# EAGLE board SP-PC-2 (EAGLE 7.6.0), part 1 of 2
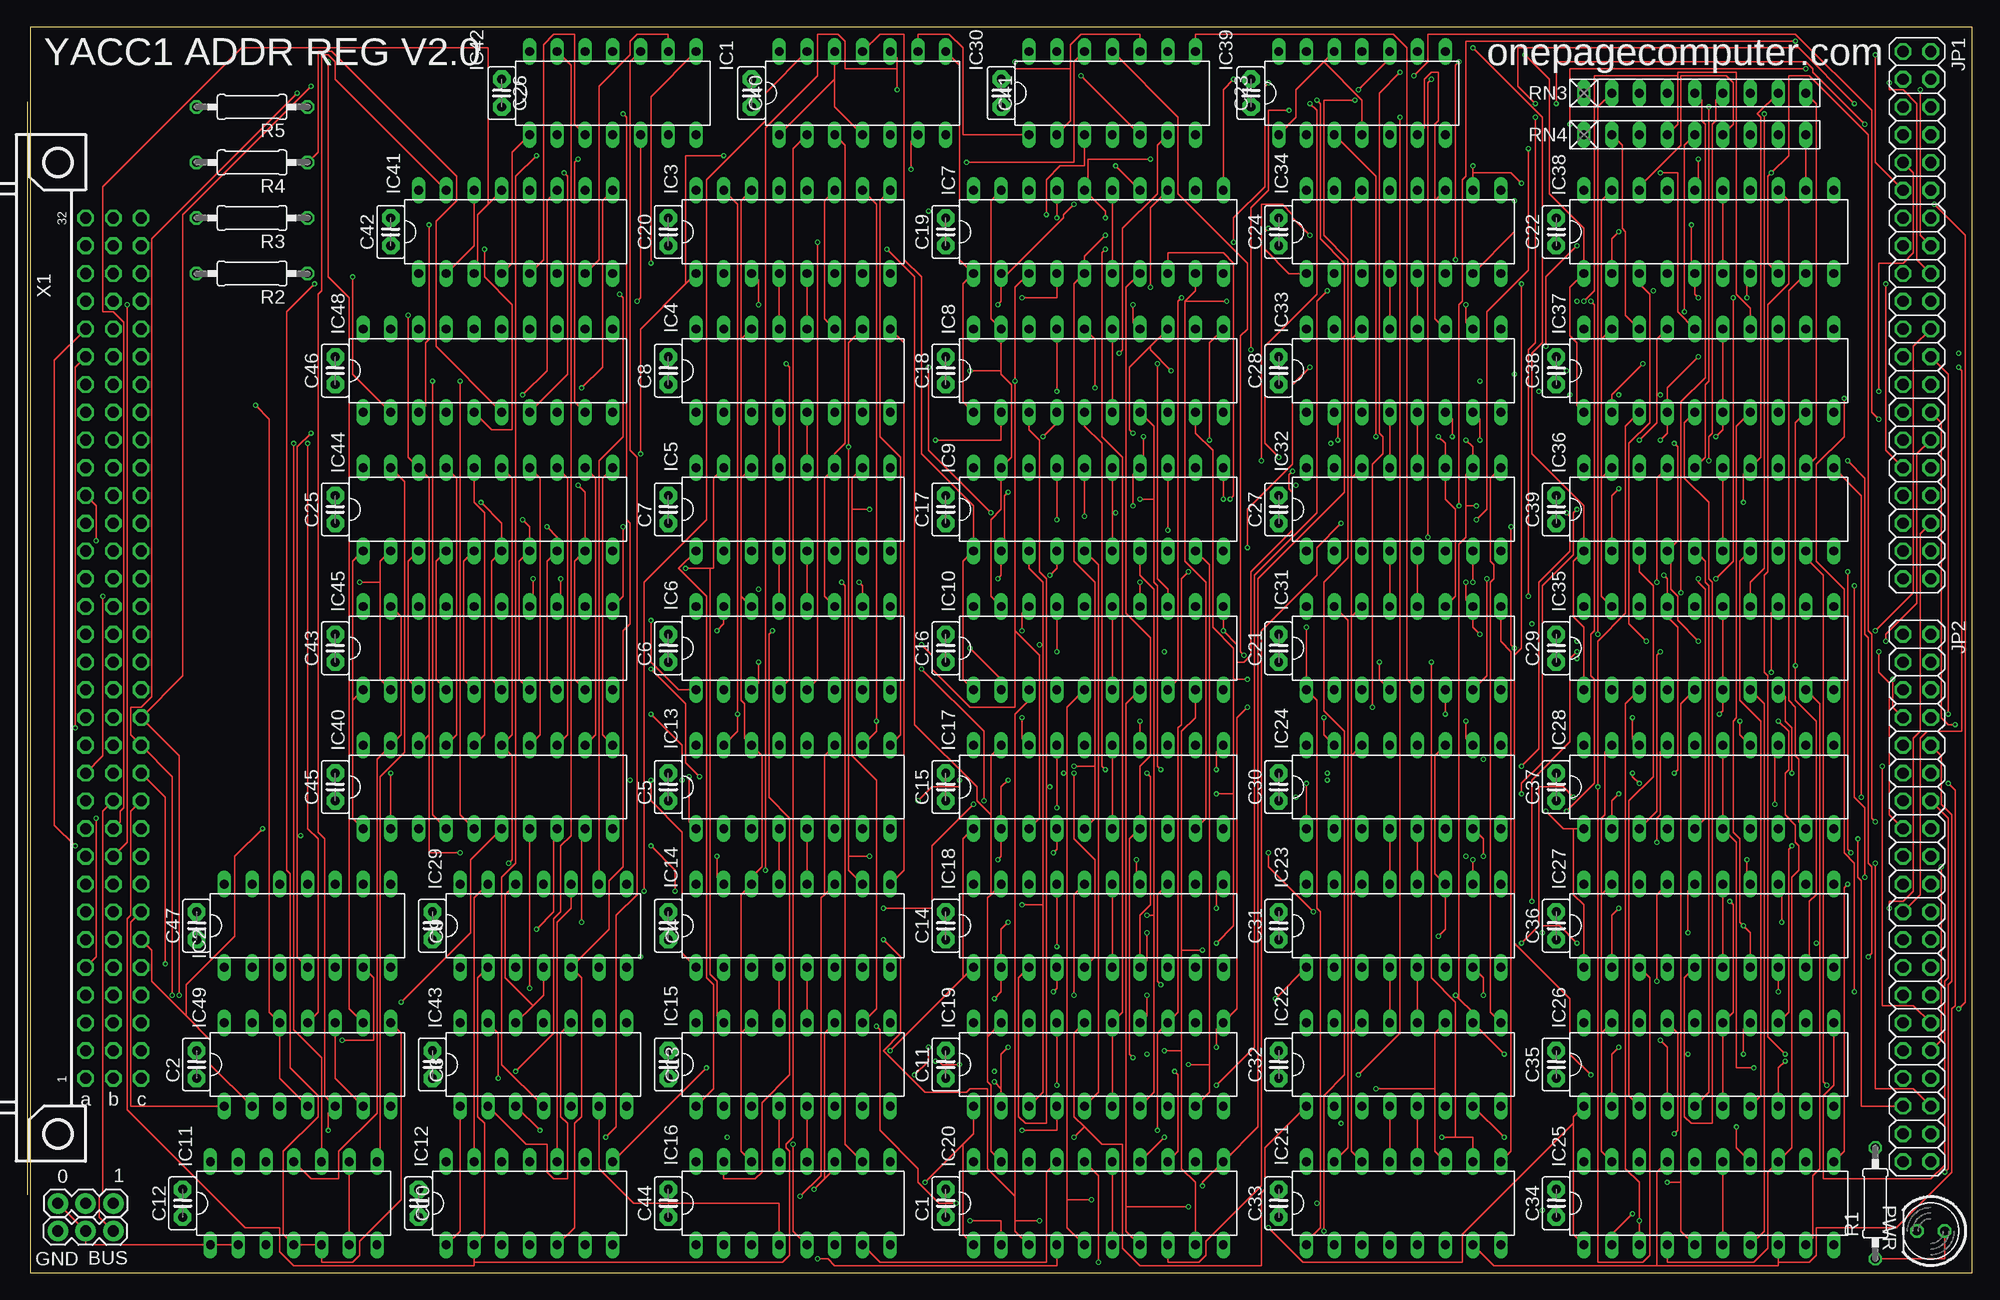
[diagram p8: board, top side]
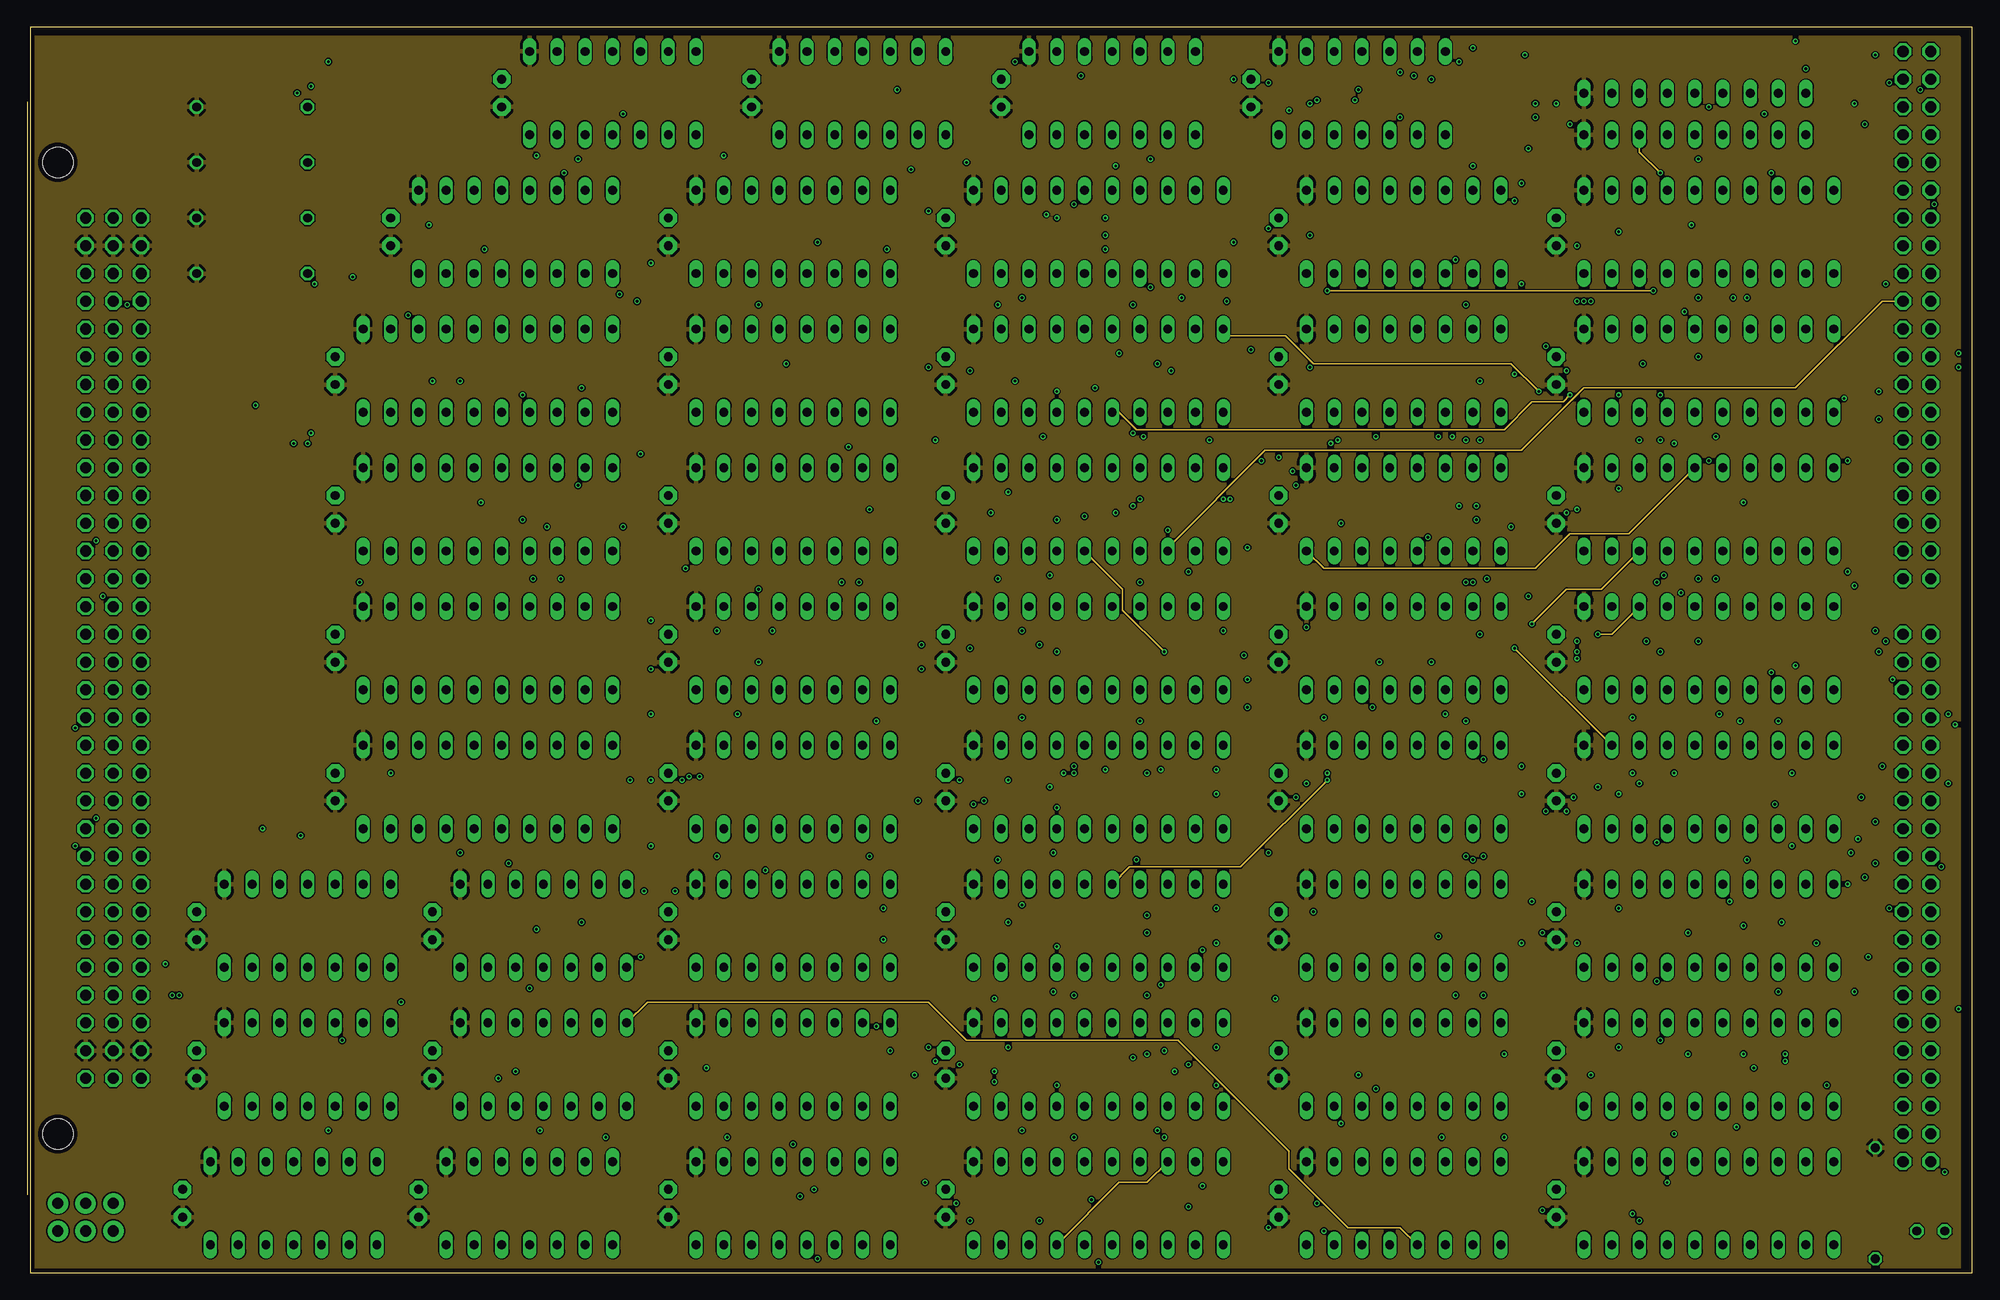
[diagram p9: board, inner layer Route2]
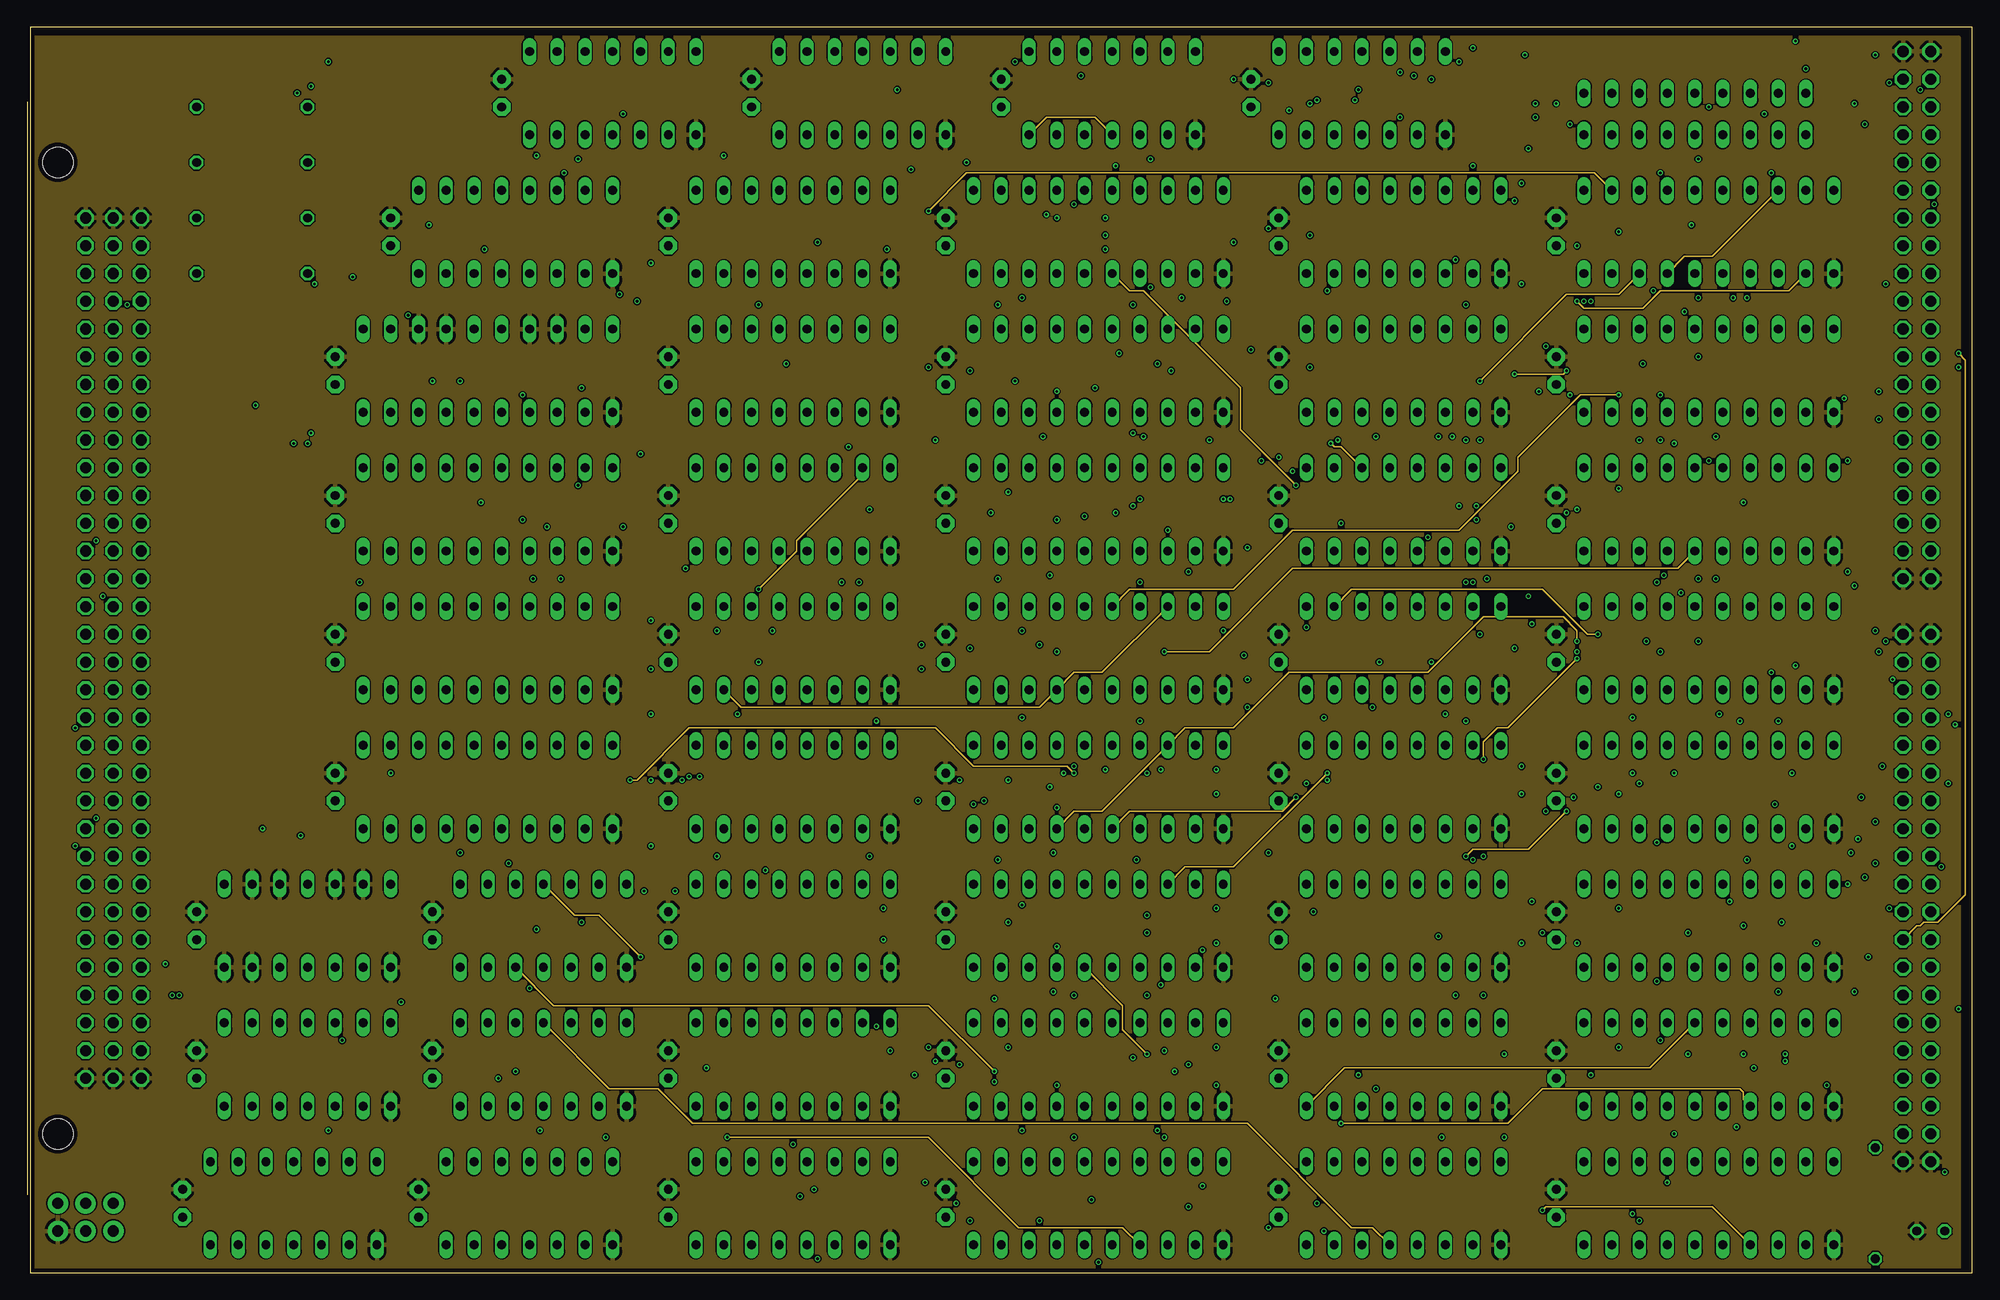
[diagram p10: board, inner layer Route15]
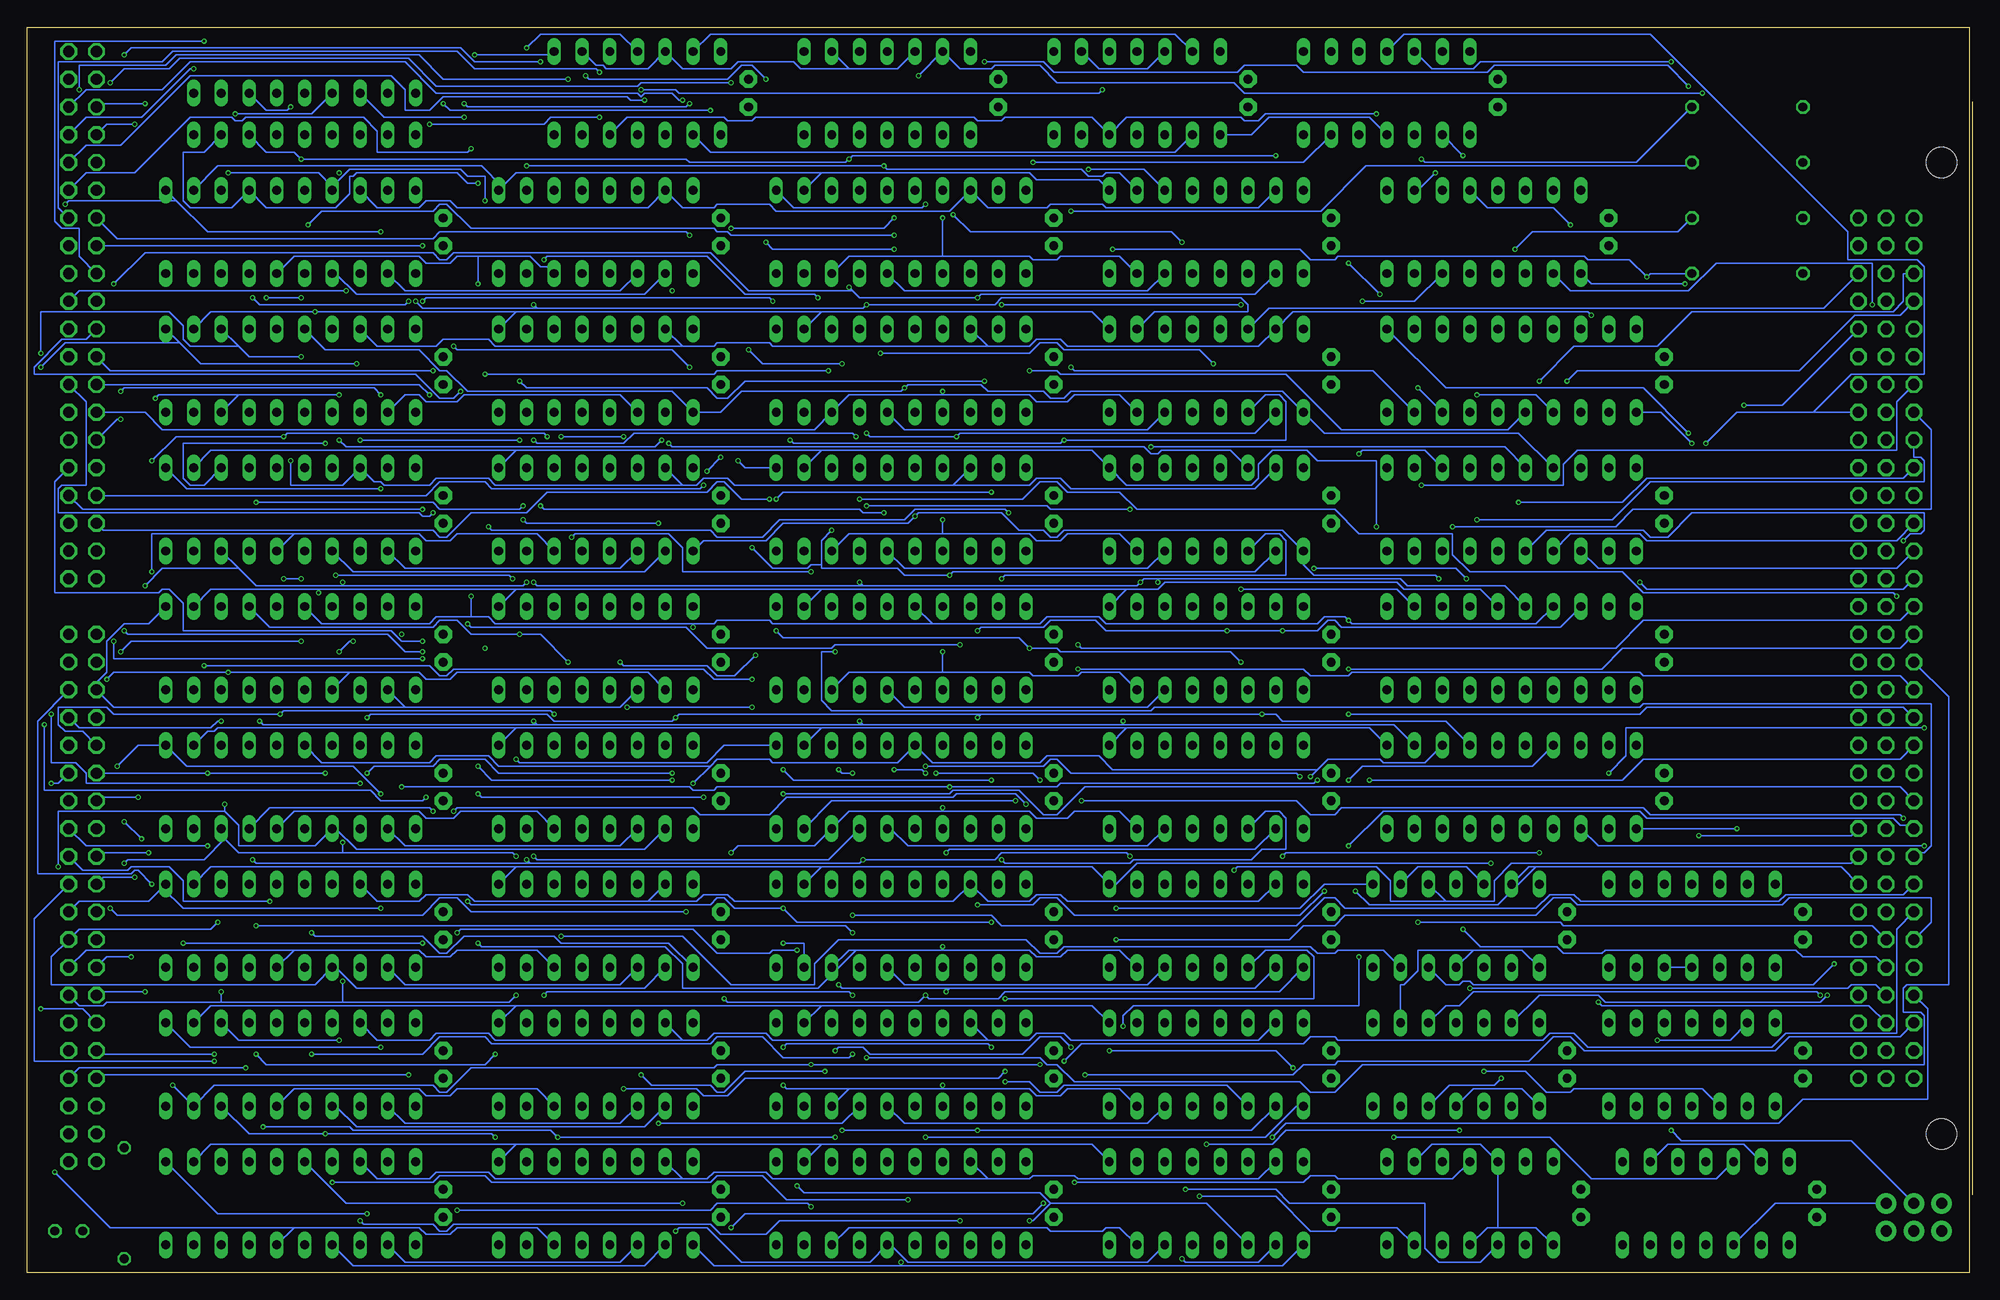
[diagram p11: board, bottom side, seen from below]

Size 177.78 x 113.97 mm. Coordinates in mm from the lower left corner, seen from the top.
Outline: 0,0 177.78,0 177.78,113.97 0,113.97 0,0
Copper layers (1*2*15*16): Top 0.035559375mm / dielectric 0.17018125mm / Route2 0.01778125mm / dielectric 47mil / Route15 0.01778125mm / dielectric 0.17018125mm / Bottom 0.035559375mm
Design rules "YACC1-OSHPark-4layer": minimum track width 5mil, minimum drill 10mil, track to track 5mil, track to pad 5mil, pad to pad 5mil, via to via 5mil, smd to smd 5mil, copper to edge 15mil, drill to drill 6mil, minimum pad ring 4mil, minimum via ring 4mil, stop-mask expansion 2.5mil, vias tented up to drill 0mil, thermal gap 10mil

## Footprints (pad centres in the part's own frame; a part is rotated, then mirrored left to right if it is on the bottom)
1X03 = drill 1.016 pad 1.88: 1 0,0; 2 2.54,0; 3 5.08,0
C2.5-2 = drill 0.813 pad 1.6 octagon: 1 -1.27,0; 2 1.27,0
DIL14 = drill 0.813 long: 1 -7.62,-3.81; 2 -5.08,-3.81; 3 -2.54,-3.81; 4 0,-3.81; 5 2.54,-3.81; 6 5.08,-3.81; 7 7.62,-3.81; 8 7.62,3.81; 9 5.08,3.81; 10 2.54,3.81; 11 0,3.81; 12 -2.54,3.81; 13 -5.08,3.81; 14 -7.62,3.81
DIL16 = drill 0.813 long: 1 -8.89,-3.81; 2 -6.35,-3.81; 3 -3.81,-3.81; 4 -1.27,-3.81; 5 1.27,-3.81; 6 3.81,-3.81; 7 6.35,-3.81; 8 8.89,-3.81; 9 8.89,3.81; 10 6.35,3.81; 11 3.81,3.81; 12 1.27,3.81; 13 -1.27,3.81; 14 -3.81,3.81; 15 -6.35,3.81; 16 -8.89,3.81
DIL20 = drill 0.813 long: 1 -11.43,-3.81; 2 -8.89,-3.81; 3 -6.35,-3.81; 4 -3.81,-3.81; 5 -1.27,-3.81; 6 1.27,-3.81; 7 3.81,-3.81; 8 6.35,-3.81; 9 8.89,-3.81; 10 11.43,-3.81; 11 11.43,3.81; 12 8.89,3.81; 13 6.35,3.81; 14 3.81,3.81; 15 1.27,3.81; 16 -1.27,3.81; 17 -3.81,3.81; 18 -6.35,3.81; 19 -8.89,3.81; 20 -11.43,3.81
2X20 = drill 1.016 octagon: 1 -24.13,-1.27; 2 -24.13,1.27; 3 -21.59,-1.27; 4 -21.59,1.27; 5 -19.05,-1.27; 6 -19.05,1.27; 7 -16.51,-1.27; 8 -16.51,1.27; 9 -13.97,-1.27; 10 -13.97,1.27; 11 -11.43,-1.27; 12 -11.43,1.27; 13 -8.89,-1.27; 14 -8.89,1.27; 15 -6.35,-1.27; 16 -6.35,1.27; 17 -3.81,-1.27; 18 -3.81,1.27; 19 -1.27,-1.27; 20 -1.27,1.27; 21 1.27,-1.27; 22 1.27,1.27; 23 3.81,-1.27; 24 3.81,1.27; 25 6.35,-1.27; 26 6.35,1.27; 27 8.89,-1.27; 28 8.89,1.27; 29 11.43,-1.27; 30 11.43,1.27; 31 13.97,-1.27; 32 13.97,1.27; 33 16.51,-1.27; 34 16.51,1.27; 35 19.05,-1.27; 36 19.05,1.27; 37 21.59,-1.27; 38 21.59,1.27; 39 24.13,-1.27; 40 24.13,1.27
LED5MM = drill 0.813 octagon: A -1.27,0; K 1.27,0
0207/10 = drill 0.813 octagon: 1 -5.08,0; 2 5.08,0
RN-9 = drill 0.813 long: 1 -10.16,0; 2 -7.62,0; 3 -5.08,0; 4 -2.54,0; 5 0,0; 6 2.54,0; 7 5.08,0; 8 7.62,0; 9 10.16,0
FABC96R = drill 1.016 octagon: A1 -2.54,39.37; A2 -2.54,36.83; A3 -2.54,34.29; A4 -2.54,31.75; A5 -2.54,29.21; A6 -2.54,26.67; A7 -2.54,24.13; A8 -2.54,21.59; A9 -2.54,19.05; A10 -2.54,16.51; A11 -2.54,13.97; A12 -2.54,11.43; A13 -2.54,8.89; A14 -2.54,6.35; A15 -2.54,3.81; A16 -2.54,1.27; A17 -2.54,-1.27; A18 -2.54,-3.81; A19 -2.54,-6.35; A20 -2.54,-8.89; A21 -2.54,-11.43; A22 -2.54,-13.97; A23 -2.54,-16.51; A24 -2.54,-19.05; A25 -2.54,-21.59; A26 -2.54,-24.13; A27 -2.54,-26.67; A28 -2.54,-29.21; A29 -2.54,-31.75; A30 -2.54,-34.29; A31 -2.54,-36.83; A32 -2.54,-39.37; B1 -5.08,39.37; B2 -5.08,36.83; B3 -5.08,34.29; B4 -5.08,31.75; B5 -5.08,29.21; B6 -5.08,26.67; B7 -5.08,24.13; B8 -5.08,21.59; B9 -5.08,19.05; B10 -5.08,16.51; B11 -5.08,13.97; B12 -5.08,11.43; B13 -5.08,8.89; B14 -5.08,6.35; B15 -5.08,3.81; B16 -5.08,1.27; B17 -5.08,-1.27; B18 -5.08,-3.81; B19 -5.08,-6.35; B20 -5.08,-8.89; B21 -5.08,-11.43; B22 -5.08,-13.97; B23 -5.08,-16.51; B24 -5.08,-19.05; B25 -5.08,-21.59; B26 -5.08,-24.13; B27 -5.08,-26.67; B28 -5.08,-29.21; B29 -5.08,-31.75; B30 -5.08,-34.29; B31 -5.08,-36.83; B32 -5.08,-39.37; C1 -7.62,39.37; C2 -7.62,36.83; C3 -7.62,34.29; C4 -7.62,31.75; C5 -7.62,29.21; C6 -7.62,26.67; C7 -7.62,24.13; C8 -7.62,21.59; C9 -7.62,19.05; C10 -7.62,16.51; C11 -7.62,13.97; C12 -7.62,11.43; C13 -7.62,8.89; C14 -7.62,6.35; C15 -7.62,3.81; C16 -7.62,1.27; C17 -7.62,-1.27; C18 -7.62,-3.81; C19 -7.62,-6.35; C20 -7.62,-8.89; C21 -7.62,-11.43; C22 -7.62,-13.97; C23 -7.62,-16.51; C24 -7.62,-19.05; C25 -7.62,-21.59; C26 -7.62,-24.13; C27 -7.62,-26.67; C28 -7.62,-29.21; C29 -7.62,-31.75; C30 -7.62,-34.29; C31 -7.62,-36.83; C32 -7.62,-39.37 | hole 2.794: 0,-44.456; 0,44.456

## Placement (x,y rotation side)
0  [1X03]  2.54,6.35 0 top
BUS  [1X03]  7.62,3.81 180 top
C1  0.1  [C2.5-2]  83.82,6.35 90 top
C2  0.1  [C2.5-2]  15.24,19.05 90 top
C3  0.1  [C2.5-2]  36.83,19.05 90 top
C4  0.1  [C2.5-2]  58.42,31.75 90 top
C5  0.1  [C2.5-2]  58.42,44.45 90 top
C6  0.1  [C2.5-2]  58.42,57.15 90 top
C7  0.1  [C2.5-2]  58.42,69.85 90 top
C8  0.1  [C2.5-2]  58.42,82.55 90 top
C9  0.1  [C2.5-2]  36.83,31.75 90 top
C10  0.1  [C2.5-2]  35.56,6.35 90 top
C11  0.1  [C2.5-2]  83.82,19.05 90 top
C12  0.1  [C2.5-2]  13.97,6.35 90 top
C13  0.1  [C2.5-2]  58.42,19.05 90 top
C14  0.1  [C2.5-2]  83.82,31.75 90 top
C15  0.1  [C2.5-2]  83.82,44.45 90 top
C16  0.1  [C2.5-2]  83.82,57.15 90 top
C17  0.1  [C2.5-2]  83.82,69.85 90 top
C18  0.1  [C2.5-2]  83.82,82.55 90 top
C19  0.1  [C2.5-2]  83.82,95.25 90 top
C20  0.1  [C2.5-2]  58.42,95.25 90 top
C21  0.1  [C2.5-2]  114.3,57.15 90 top
C22  0.1  [C2.5-2]  139.7,95.25 90 top
C23  0.1  [C2.5-2]  111.76,107.95 90 top
C24  0.1  [C2.5-2]  114.3,95.25 90 top
C25  0.1  [C2.5-2]  27.94,69.85 90 top
C26  0.1  [C2.5-2]  43.18,107.95 90 top
C27  0.1  [C2.5-2]  114.3,69.85 90 top
C28  0.1  [C2.5-2]  114.3,82.55 90 top
C29  0.1  [C2.5-2]  139.7,57.15 90 top
C30  0.1  [C2.5-2]  114.3,44.45 90 top
C31  0.1  [C2.5-2]  114.3,31.75 90 top
C32  0.1  [C2.5-2]  114.3,19.05 90 top
C33  0.1  [C2.5-2]  114.3,6.35 90 top
C34  0.1  [C2.5-2]  139.7,6.35 90 top
C35  0.1  [C2.5-2]  139.7,19.05 90 top
C36  0.1  [C2.5-2]  139.7,31.75 90 top
C37  0.1  [C2.5-2]  139.7,44.45 90 top
C38  0.1  [C2.5-2]  139.7,82.55 90 top
C39  0.1  [C2.5-2]  139.7,69.85 90 top
C40  0.1  [C2.5-2]  66.04,107.95 90 top
C41  0.1  [C2.5-2]  88.9,107.95 90 top
C42  0.1  [C2.5-2]  33.02,95.25 90 top
C43  0.1  [C2.5-2]  27.94,57.15 90 top
C44  0.1  [C2.5-2]  58.42,6.35 90 top
C45  0.1  [C2.5-2]  27.94,44.45 90 top
C46  0.1  [C2.5-2]  27.94,82.55 90 top
C47  0.1  [C2.5-2]  15.24,31.75 90 top
IC1  7400N  [DIL14]  76.2,107.95 0 top
IC2  7400N  [DIL14]  25.4,31.75 0 top
IC3  74LS192N  [DIL16]  69.85,95.25 0 top
IC4  74LS192N  [DIL16]  69.85,82.55 0 top
IC5  74LS192N  [DIL16]  69.85,69.85 0 top
IC6  74LS192N  [DIL16]  69.85,57.15 0 top
IC7  74LS244N  [DIL20]  97.79,95.25 0 top
IC8  74LS244N  [DIL20]  97.79,82.55 0 top
IC9  74LS244N  [DIL20]  97.79,69.85 0 top
IC10  74LS244N  [DIL20]  97.79,57.15 0 top
IC11  7400N  [DIL14]  24.13,6.35 0 top
IC12  7400N  [DIL14]  45.72,6.35 0 top
IC13  74LS192N  [DIL16]  69.85,44.45 0 top
IC14  74LS192N  [DIL16]  69.85,31.75 0 top
IC15  74LS192N  [DIL16]  69.85,19.05 0 top
IC16  74LS192N  [DIL16]  69.85,6.35 0 top
IC17  74LS244N  [DIL20]  97.79,44.45 0 top
IC18  74LS244N  [DIL20]  97.79,31.75 0 top
IC19  74LS244N  [DIL20]  97.79,19.05 0 top
IC20  74LS244N  [DIL20]  97.79,6.35 0 top
IC21  74LS192N  [DIL16]  125.73,6.35 0 top
IC22  74LS192N  [DIL16]  125.73,19.05 0 top
IC23  74LS192N  [DIL16]  125.73,31.75 0 top
IC24  74LS192N  [DIL16]  125.73,44.45 0 top
IC25  74LS244N  [DIL20]  153.67,6.35 0 top
IC26  74LS244N  [DIL20]  153.67,19.05 0 top
IC27  74LS244N  [DIL20]  153.67,31.75 0 top
IC28  74LS244N  [DIL20]  153.67,44.45 0 top
IC29  7400N  [DIL14]  46.99,31.75 0 top
IC30  7400N  [DIL14]  99.06,107.95 0 top
IC31  74LS192N  [DIL16]  125.73,57.15 0 top
IC32  74LS192N  [DIL16]  125.73,69.85 0 top
IC33  74LS192N  [DIL16]  125.73,82.55 0 top
IC34  74LS192N  [DIL16]  125.73,95.25 0 top
IC35  74LS244N  [DIL20]  153.67,57.15 0 top
IC36  74LS244N  [DIL20]  153.67,69.85 0 top
IC37  74LS244N  [DIL20]  153.67,82.55 0 top
IC38  74LS244N  [DIL20]  153.67,95.25 0 top
IC39  7400N  [DIL14]  121.92,107.95 0 top
IC40  74LS245N  [DIL20]  41.91,44.45 0 top
IC41  74LS139N  [DIL16]  44.45,95.25 0 top
IC42  74LS04N  [DIL14]  53.34,107.95 0 top
IC43  7400N  [DIL14]  46.99,19.05 0 top
IC44  74LS245N  [DIL20]  41.91,69.85 0 top
IC45  74LS245N  [DIL20]  41.91,57.15 0 top
IC48  74LS374N  [DIL20]  41.91,82.55 0 top
IC49  74LS32N  [DIL14]  25.4,19.05 0 top
JP1  [2X20]  172.72,87.63 270 top
JP2  [2X20]  172.72,34.29 270 top
PWR  l1  [LED5MM]  173.99,3.81 180 top
R1  330  [0207/10]  168.91,6.35 90 top
R2  10k  [0207/10]  20.32,91.44 180 top
R3  10k  [0207/10]  20.32,96.52 180 top
R4  10k  [0207/10]  20.32,101.6 180 top
R5  10k  [0207/10]  20.32,106.68 180 top
RN3  [RN-9]  152.4,107.95 0 top
RN4  [RN-9]  152.4,104.14 0 top
X1  FABC96R  [FABC96R]  2.54,57.15 180 top

## Tracks (layer width: path | path; a pad name or v marks a point on that pad's centre or on a via)
-ADDR-ID2-SEL
  Bottom 0.127: IC11.3 17.78,6.35 0.3
-BRD-SEL  (via drill 0.25)
  Top 0.127: v27.3,13.02 27.3,14.61 IC49.5 26.99,16.19 26.99,39.69 26.35,40.32 26.35,89.53 26.67,89.85 26.67,111.44 27.3,111.44 27.94,110.81 27.94,109.22 IC41.15
  Bottom 0.127: v27.3,13.02 26.35,12.06 10.79,12.06 0.2
-BUS-EN  (via drill 0.25)
  Top 0.127: IC49.4 22.86,17.78 IC49.12 21.91,23.81 21.91,78.11 v20.64,79.38
  Bottom 0.127: X1.C28 17.14,79.38 v20.64,79.38
-INDIRECT0  (via drill 0.25)
  Top 0.127: v55.56,88.9 55.88,89.22 IC42.5
  Bottom 0.127: IC41.6 50.8,88.9 v55.56,88.9
-INDIRECT1
  Top 0.127: IC41.7 52.07,92.71 52.07,108.58 54.93,111.44 54.93,112.71 55.56,113.35 58.42,113.35 IC42.9
-IREG0-ADDR-OUT  (via drill 0.25)
  Top 0.127: IC35.19 143.83,61.91 143.83,72.71 | IC36.19 143.83,72.71 | 143.83,85.41 IC37.19 | 143.83,72.71 143.83,85.41 | IC38.19 143.83,98.11 143.83,85.41 | IC48.6 37.15,84.77 37.15,96.2 39.05,98.11 39.05,100.33 27.62,111.76 26.35,111.76 26.35,102.55 R4.1
  Route15 0.127: IC38.19 143.19,100.65 85.72,100.65 v82.23,97.16
  Bottom 0.127: v82.23,97.16 59.37,97.16 55.24,101.28 25.72,101.28 R4.1
-IREG1-ADDR-OUT  (via drill 0.25)
  Top 0.127: IC25.19 143.83,11.11 143.83,21.91 | IC26.19 143.83,21.91 | 143.83,34.61 IC27.19 | 143.83,21.91 143.83,34.61 | IC28.19 144.15,47.62 144.15,41.91 143.83,41.59 143.83,34.61 | IC48.9 49.85,79.69 49.85,101.6 v50.16,101.92 | v135.89,57.15 135.57,57.47 v135.57,68.26 | v87.95,69.53 82.23,75.25 v82.23,82.87
  Route2 0.127: v135.89,57.15 IC28.19
  Bottom 0.127: v50.16,101.92 49.85,101.6 30.48,101.6 R5.1 | v135.57,68.26 135.25,67.94 115.25,67.94 114.62,67.31 110.49,67.31 108.9,68.9 97.47,68.9 96.52,69.85 88.27,69.85 v87.95,69.53 | v82.23,82.87 81.92,82.55 54.61,82.55 IC48.9
-PC-ADDR-OUT  (via drill 0.25)
  Top 0.127: IC48.2 29.53,82.23 v29.53,91.12 | IC20.19 87.95,11.11 87.95,17.14 87.63,17.46 87.63,21.59 | IC19.19 87.63,21.59 | 87.95,34.61 87.63,34.29 87.63,21.59 | 87.95,34.61 IC18.19 | IC17.19 87.95,47.31 87.95,41.91 | 87.95,34.61 87.95,41.91 | v78.42,93.66 80.96,91.12 80.96,50.16 86.68,44.45 86.68,43.18 87.95,41.91
  Bottom 0.127: R2.1 29.21,91.44 v29.53,91.12 31.11,92.71 34.92,92.71 35.24,93.03 57.78,93.03 58.1,92.71 60.33,92.71 61.28,93.66 v78.42,93.66
-SP
  Top 0.127: IC41.5 46.99,92.71 46.99,112.39 47.94,113.35 49.85,113.35 49.85,105.09 IC42.3
-SP-ADDR-OUT  (via drill 0.25)
  Top 0.127: IC48.5 42.23,77.15 44.13,77.15 44.13,88.58 41.59,91.12 v41.59,93.66 | IC10.19 87.95,61.91 87.95,68.9 88.9,69.85 IC9.19 89.85,74.61 89.85,81.28 88.9,82.23 88.9,82.55 | IC7.19 87.95,98.11 87.95,87.31 IC8.19 88.9,82.55 | 88.9,82.55 v86.04,82.55
  Bottom 0.127: v41.59,93.66 40.01,95.25 26.67,95.25 R3.1 | IC48.5 42.23,77.15 57.47,77.15 62.55,82.23 83.19,82.23 83.5,82.55 v86.04,82.55
-SPC
  Top 0.127: IC41.4 44.13,92.39 44.13,102.55 IC42.1
ADATA0  (via drill 0.25)
  Top 0.127: v62.87,58.74 63.5,59.37 IC6.15 | IC10.18 90.81,60.33 v90.81,58.74 | RN3.2 143.51,106.68 v143.51,58.42 | IC31.15 120.65,59.69 120.65,11.43 IC21.15 | v67.94,58.74 67.63,58.42 67.63,43.5 69.53,41.59 69.53,18.1 66.99,15.56 66.99,9.21 66.36,8.57 63.5,8.57 IC16.15
  Route2 0.127: v143.51,58.42 144.78,58.42 IC35.18
  Route15 0.127: v143.51,58.42 142.56,58.42 138.43,62.55 120.97,62.55 IC31.15
  Bottom 0.127: IC45.18 37.47,59.05 57.47,59.05 58.1,59.69 58.74,59.69 59.69,58.74 v62.87,58.74 v67.94,58.74 79.06,58.74 80.01,59.69 84.14,59.69 84.77,59.05 90.49,59.05 v90.81,58.74 | IC16.15 65.09,8.57 81.6,8.57 81.92,8.89 85.72,8.89 86.04,8.57 89.85,8.57 | IC20.18 89.85,8.57 | 117.79,8.57 IC21.15 | 117.79,8.57 115.57,8.57 114.94,9.21 110.17,9.21 109.54,8.57 89.85,8.57 | IC25.18 145.73,8.57 140.97,8.57 140.34,9.21 135.57,9.21 134.94,8.57 117.79,8.57
ADATA1  (via drill 0.25)
  Top 0.127: IC20.16 97.79,8.89 v97.79,0.95 | 118.11,6.35 118.11,4.13 116.84,2.86 IC21.1 | 118.11,6.35 118.11,33.02 117.79,33.34 117.79,52.39 IC31.1 v116.84,59.05 | 118.11,6.35 v117.79,6.35 | IC6.1 59.37,53.34 56.83,55.88 v56.83,59.69 | v137.79,105.73 137.79,85.09 137.16,84.45 v137.16,61.91
  Bottom 0.127: IC16.1 62.87,0.64 97.79,0.64 | 97.79,0.64 114.94,0.64 IC21.1 | 97.79,0.64 v97.79,0.95 | IC25.16 148.59,6.35 v117.79,6.35 | IC45.17 39.69,59.37 56.52,59.37 v56.83,59.69 57.15,60.01 59.05,60.01 59.69,59.37 79.06,59.37 79.69,60.01 84.45,60.01 85.09,59.37 94.93,59.37 | 94.93,59.37 IC10.16 | IC35.16 150.81,59.37 140.97,59.37 140.34,60.01 137.16,60.01 | 137.16,60.01 135.57,60.01 134.94,59.37 116.84,59.37 | 116.84,59.37 114.94,59.37 114.62,59.69 109.86,59.69 109.54,59.37 94.93,59.37 | RN3.3 145.1,105.73 v137.79,105.73 | 137.16,60.01 v137.16,61.91 | 116.84,59.37 v116.84,59.05
ADATA2  (via drill 0.25)
  Top 0.127: v103.82,12.38 IC20.14 | 130.49,12.38 132.08,12.38 IC21.10 | 130.49,12.38 v129.22,12.38 | IC25.14 156.21,11.43 v156.21,13.34 | v75.88,63.18 76.2,62.87 IC6.10 | IC16.10 74.61,11.75 74.61,62.87 v74.3,63.18 | v101.6,63.18 IC10.14 | v131.44,63.18 131.44,61.59 IC31.10 132.08,59.05 v132.72,58.42 | v158.75,106.05 158.75,64.45 157.48,63.18 IC35.14 | 130.49,12.38 130.49,24.77 128.27,26.99 v128.27,55.88
  Bottom 0.127: v103.82,12.38 v129.22,12.38 129.86,13.02 147.96,13.02 148.27,13.34 v156.21,13.34 | IC45.16 42.55,62.87 51.44,62.87 52.07,63.5 74.3,63.5 | 74.3,63.5 75.56,63.5 v75.88,63.18 76.2,62.87 101.28,62.87 | 74.3,63.5 v74.3,63.18 | 101.28,62.87 v101.6,63.18 | v131.44,63.18 131.13,62.87 101.28,62.87 | IC35.14 155.57,59.05 140.65,59.05 140.02,59.69 138.43,59.69 137.16,58.42 v132.72,58.42 130.81,58.42 v128.27,55.88 | RN3.4 151.76,106.05 v158.75,106.05
ADATA3  (via drill 0.25)
  Top 0.127: RN3.5 153.03,107.31 153.03,105.41 153.35,105.09 153.35,81.92 151.13,79.69 v151.13,62.23 | IC21.9 135.57,11.11 135.57,56.83 134.62,57.78 IC31.9
  Bottom 0.127: IC16.9 80.33,11.75 105.09,11.75 | IC20.12 105.09,11.75 | 133.03,11.75 IC21.9 | 105.09,11.75 133.03,11.75 | IC25.12 160.97,11.75 133.03,11.75 | IC45.15 44.77,62.55 51.75,62.55 52.39,63.18 73.66,63.18 74.3,62.55 77.15,62.55 | IC6.9 77.15,62.55 | 105.09,62.55 IC10.12 | 77.15,62.55 105.09,62.55 | 133.03,62.55 IC31.9 | 105.09,62.55 133.03,62.55 | IC35.12 160.97,62.55 151.13,62.55 | 133.03,62.55 151.13,62.55 | 151.13,62.55 v151.13,62.23
ADATA4  (via drill 0.25)
  Top 0.127: IC45.14 46.04,61.28 v46.04,63.5 | 62.23,64.45 62.55,64.45 62.55,72.71 IC5.15 | 62.23,64.45 v60.01,64.45 | RN3.6 154.31,107.31 154.31,105.41 153.99,105.09 153.99,76.83 153.67,76.52 v153.67,74.3 | IC15.15 62.87,23.5 62.87,26.67 62.23,27.3 62.23,64.45
  Bottom 0.127: IC15.15 65.09,21.27 82.23,21.27 82.87,21.91 85.41,21.91 86.04,21.27 89.85,21.27 | IC19.18 89.85,21.27 | 117.79,21.27 IC22.15 | 117.79,21.27 115.57,21.27 114.94,21.91 110.17,21.91 109.54,21.27 89.85,21.27 | IC26.18 145.73,21.27 140.97,21.27 140.34,21.91 135.57,21.91 134.94,21.27 117.79,21.27 | v46.04,63.5 46.99,64.45 v60.01,64.45 | 93.03,72.07 IC9.18 | 93.03,72.07 113.03,72.07 113.67,72.71 115.89,72.71 116.52,72.07 117.79,72.07 | IC32.15 117.79,72.07 | 117.79,72.07 134.94,72.07 135.57,72.71 140.34,72.71 140.97,72.07 145.1,72.07 145.41,72.39 146.05,72.39 IC36.18 148.91,72.07 153.67,72.07 v153.67,74.3 | IC5.15 65.41,71.75 82.23,71.75 83.19,72.71 85.41,72.71 86.04,72.07 93.03,72.07
ADATA5  (via drill 0.25)
  Top 0.127: IC19.16 95.57,21.91 95.57,14.29 96.52,13.34 | 96.52,13.34 98.11,11.75 100.01,11.75 100.01,2.22 101.6,0.64 112.71,0.64 112.71,7.3 113.03,7.62 113.03,11.43 IC22.1 | IC36.16 153.35,74.61 153.35,81.28 153.67,81.6 v153.67,106.68 | v96.52,69.22 IC9.16 | IC45.13 48.58,61.28 v48.58,63.5 | IC15.1 62.55,16.83 62.55,26.35 61.91,26.99 61.91,61.91 59.37,64.45 IC5.1 | v95.57,12.38 96.52,13.34
  Route2 0.127: IC36.16 146.37,67.63 140.97,67.63 137.79,64.45 118.43,64.45 IC32.1
  Route15 0.127: IC26.16 148.27,18.73 120.33,18.73 IC22.1
  Bottom 0.127: v153.67,106.68 153.99,106.36 155.89,106.36 RN3.7 | IC32.1 115.89,66.99 110.17,66.99 108.58,68.58 97.16,68.58 v96.52,69.22 96.2,69.53 88.58,69.53 87,67.94 84.77,67.94 84.14,67.31 83.5,67.31 82.87,67.94 62.87,67.94 IC5.1 60.96,64.77 60.01,63.82 48.9,63.82 v48.58,63.5 | v95.57,12.38 64.45,12.38 61.59,15.24 IC15.1
ADATA6  (via drill 0.25)
  Top 0.127: IC15.10 77.47,24.13 77.47,45.09 75.25,47.31 75.25,69.85 | 75.25,69.85 75.25,72.71 IC5.10 | v100.97,70.17 100.97,73.03 IC9.14 101.92,73.98 v101.92,76.52 | 75.25,69.85 v76.83,69.85 | RN3.8 158.12,106.05 158.43,105.73 158.43,74.61 IC36.14 156.84,73.03 v156.84,70.48 | IC19.14 102.23,23.5 v102.23,25.4 | 130.81,25.08 132.08,23.81 IC22.10 v134.94,20 | 130.81,25.08 v130.49,25.4 | IC26.14 156.84,22.23 v156.84,20 | 131.44,70.17 131.44,67.31 130.81,66.67 130.81,25.08 | 131.44,70.17 131.44,73.03 IC32.10 132.08,75.56 v131.44,76.2 | 131.44,70.17 v132.4,70.17
  Route15 0.127: v66.67,62.55 70.17,66.04 70.17,66.99 76.2,73.03 IC5.10
  Bottom 0.127: IC45.12 52.39,62.55 v66.67,62.55 | v100.97,70.17 84.45,70.17 84.14,69.85 v76.83,69.85 | v102.23,25.4 102.55,25.72 130.18,25.72 v130.49,25.4 | v156.84,20 155.89,19.05 135.89,19.05 v134.94,20 | v156.84,70.48 140.65,70.48 140.02,69.85 132.72,69.85 v132.4,70.17 | v101.92,76.52 102.23,76.83 122.24,76.83 123.19,75.88 131.13,75.88 v131.44,76.2
ADATA7  (via drill 0.25)
  Top 0.127: IC45.11 54.29,61.91 v54.29,68.26 | RN3.9 163.51,107 163.51,74.61 IC36.12 | IC22.9 133.67,23.81 133.67,63.18 133.99,63.5 133.99,64.77 133.67,65.09 133.67,72.71 IC32.9
  Bottom 0.127: IC15.9 80.33,24.45 105.09,24.45 | IC19.12 105.09,24.45 | 133.03,24.45 IC22.9 | 105.09,24.45 133.03,24.45 | IC26.12 160.97,24.45 133.03,24.45 | v54.29,68.26 54.29,74.3 59.69,74.3 60.64,75.25 63.82,75.25 65.09,73.98 65.09,72.71 65.72,72.07 77.15,72.07 IC5.9 80.33,75.25 105.09,75.25 | 105.09,75.25 IC9.12 | 133.03,75.25 IC32.9 | 105.09,75.25 133.03,75.25 | IC36.12 160.97,75.25 133.03,75.25
ADATA8  (via drill 0.25)
  Top 0.127: 36.51,49.21 IC40.18 | 36.51,49.21 36.51,72.71 IC44.18 34.61,74.61 v34.61,87.63 | RN4.2 145.73,103.19 145.73,95.57 146.05,95.25 146.05,87.63 IC37.18 | IC14.15 62.87,36.2 v62.87,38.1 | v39.37,38.42 36.51,38.42 36.51,49.21
  Bottom 0.127: IC14.15 65.09,33.97 82.55,33.97 83.19,34.61 85.41,34.61 86.04,33.97 89.85,33.97 IC18.18 93.03,33.97 113.03,33.97 113.67,34.61 115.89,34.61 116.52,33.97 120.97,33.97 | 120.97,33.97 IC23.15 | 120.97,33.97 136.84,33.97 137.48,34.61 141.29,34.61 141.92,33.97 145.73,33.97 IC27.18 | 89.85,84.77 86.04,84.77 85.41,85.41 83.19,85.41 82.55,84.77 65.09,84.77 IC4.15 61.91,87.95 34.92,87.95 v34.61,87.63 | IC8.18 89.85,84.77 | 117.79,84.77 IC33.15 | 117.79,84.77 114.94,84.77 114.62,85.09 109.86,85.09 109.54,84.77 89.85,84.77 | IC37.18 145.73,84.77 140.34,84.77 139.7,85.41 135.57,85.41 134.94,84.77 117.79,84.77 | v62.87,38.1 62.55,38.42 v39.37,38.42
ADATA9  (via drill 0.25)
  Top 0.127: IC8.16 97.47,85.41 v97.47,80.96 | v149.22,100.65 150.81,100.65 150.81,87.95 IC37.16 | IC14.1 59.69,29.21 59.69,40.32 56.83,43.18 v56.83,45.09 | IC18.16 95.57,34.61 v95.57,25.4 | v113.98,25.08 IC23.1 | IC27.16 151.76,34.92 v151.76,31.11 | IC44.17 39.05,72.71 39.05,49.21 IC40.17
  Route2 0.127: RN4.3 147.32,102.55 v149.22,100.65
  Bottom 0.127: IC37.16 150.5,84.45 141.92,84.45 140.02,82.55 139.38,82.55 137.48,80.64 118.75,80.64 IC33.1 114.3,78.74 112.39,80.64 97.79,80.64 v97.47,80.96 97.16,81.28 90.49,81.28 89.85,80.64 84.77,80.64 84.14,80.01 82.87,80.01 82.23,80.64 62.87,80.64 IC4.1 59.05,76.83 41.27,76.83 IC44.17 | v56.83,45.09 55.56,46.35 40.01,46.35 IC40.17 | IC14.1 63.18,25.72 88.27,25.72 88.9,25.08 95.25,25.08 v95.57,25.4 96.2,24.77 113.67,24.77 v113.98,25.08 | v151.76,31.11 151.45,30.8 141.6,30.8 140.02,29.21 139.38,29.21 137.79,30.8 129.54,30.8 128.91,30.16 119.06,30.16 IC23.1
ADATA10  (via drill 0.25)
  Top 0.127: RN4.4 150.81,105.09 150.81,109.54 | 150.81,109.54 150.81,109.86 156.21,109.86 156.21,89.53 157.48,88.27 IC37.14 | IC40.16 41.59,49.21 41.59,69.53 40.64,70.48 IC44.16 | IC14.10 74.93,36.83 74.93,38.1 | 74.93,38.1 v74.93,75.56 74.93,85.09 IC4.10 | IC18.14 101.28,35.88 v101.28,37.78 | 74.93,38.1 v76.83,38.1 | v132.08,37.78 IC23.10 | IC27.14 157.16,35.88 v157.16,37.78 | IC8.14 100.97,87 v100.97,88.58 | IC33.10 131.44,87 v131.44,88.58 | 150.81,109.54 143.19,109.54 143.19,89.85 v142.24,88.9
  Bottom 0.127: v76.83,38.1 77.15,38.42 88.58,38.42 89.22,37.78 v101.28,37.78 101.6,37.47 131.76,37.47 | 131.76,37.47 v132.08,37.78 | v157.16,37.78 156.84,37.47 131.76,37.47 | IC4.10 74.61,87.95 66.04,87.95 66.04,88.58 66.67,89.22 88.58,89.22 89.22,88.58 v100.97,88.58 101.28,88.27 131.13,88.27 | 131.13,88.27 v131.44,88.58 | IC44.16 42.55,75.56 v74.93,75.56 | v142.24,88.9 141.6,88.27 131.13,88.27
ADATA11  (via drill 0.25)
  Top 0.127: RN4.5 151.45,103.19 v151.45,87.95 | IC44.15 44.13,72.71 44.13,49.21 IC40.15 44.13,47.31 44.13,37.78 v43.81,37.47 | IC4.9 80.01,85.09 80.01,36.83 IC14.9
  Bottom 0.127: IC4.9 80.33,87.95 105.09,87.95 | IC8.12 105.09,87.95 | 133.03,87.95 IC33.9 | 105.09,87.95 133.03,87.95 | IC37.12 160.97,87.95 v151.45,87.95 133.03,87.95 | 105.09,37.15 80.33,37.15 IC14.9 78.11,35.56 76.2,37.47 v43.81,37.47 | IC18.12 105.09,37.15 | 133.03,37.15 IC23.9 | 105.09,37.15 133.03,37.15 | IC27.12 160.97,37.15 133.03,37.15
ADATA12  (via drill 0.25)
  Top 0.127: IC40.14 46.67,49.21 46.67,72.71 IC44.14 | IC17.18 90.81,48.9 v90.81,50.8 | IC24.15 118.43,49.21 v118.43,50.8 | IC28.18 146.69,48.9 v146.69,50.8 | RN4.6 155.89,105.09 155.89,108.9 155.26,109.54 151.13,109.54 151.13,103.19 147.32,99.38 IC38.18 | IC13.15 64.77,49.53 v64.77,51.12 64.77,97.79 IC3.15
  Bottom 0.127: 90.49,51.12 v90.81,50.8 | 90.49,51.12 v64.77,51.12 63.5,51.12 62.87,50.48 47.94,50.48 IC40.14 | 90.49,51.12 118.11,51.12 v118.43,50.8 118.75,50.48 129.54,50.48 130.18,51.12 146.37,51.12 v146.69,50.8 | IC38.18 145.73,97.47 141.92,97.47 141.29,98.11 139.06,98.11 138.43,97.47 120.97,97.47 IC34.15 117.79,97.47 114.94,97.47 114.62,97.79 109.86,97.79 109.22,97.16 93.34,97.16 IC7.18 89.85,97.47 84.45,97.47 84.14,97.79 79.38,97.79 79.06,97.47 65.09,97.47 IC3.15
ADATA13  (via drill 0.25)
  Top 0.127: IC38.16 152.72,99.38 v152.72,101.92 | 96.84,98.74 98.42,97.16 v98.42,96.52 | v113.35,95.57 113.03,95.25 113.03,93.66 115.25,91.44 IC34.1 | v102.55,101.92 96.84,101.92 96.84,98.74 | 96.84,98.74 IC7.16 | IC13.1 60.33,41.27 v60.33,45.4 | v116.84,44.77 IC24.1 | IC44.13 49.21,72.71 49.21,49.21 IC40.13 | 60.01,90.49 55.88,86.36 v55.88,74.93 | 60.01,90.49 IC3.1 | v63.5,102.23 60.01,102.23 60.01,90.49
  Bottom 0.127: RN4.7 155.89,102.55 153.35,102.55 v152.72,101.92 117.47,101.92 117.16,101.6 102.87,101.6 v102.55,101.92 102.23,102.23 v63.5,102.23 | v98.42,96.52 99.38,95.57 v113.35,95.57 | 59.69,46.04 58.74,46.99 53.98,46.99 53.66,46.67 49.85,46.67 IC40.13 | 59.69,46.04 v60.33,45.4 | 59.69,46.04 78.42,46.04 79.69,47.31 84.45,47.31 85.09,46.67 94.93,46.67 IC17.16 98.11,46.67 109.54,46.67 109.86,46.99 114.62,46.99 115.25,46.35 | 115.25,46.35 v116.84,44.77 | IC28.16 150.81,46.67 140.97,46.67 140.34,47.31 135.57,47.31 134.62,46.35 115.25,46.35 | v55.88,74.93 55.56,75.25 49.85,75.25 IC44.13
ADATA14  (via drill 0.25)
  Top 0.127: IC40.12 51.75,49.21 51.75,72.71 IC44.12 | v101.6,50.48 IC17.14 | IC24.10 131.44,48.9 v131.44,50.48 | IC28.14 156.53,49.21 v156.53,50.48 | IC13.10 77.47,49.53 v77.47,50.48 77.47,97.79 IC3.10 | v99.38,101.28 IC7.14 | v132.08,101.28 132.08,100.65 | 132.08,100.65 IC34.10 | v136.53,99.69 135.57,100.65 132.08,100.65
  Bottom 0.127: 101.28,50.16 v101.6,50.48 | 77.47,50.16 52.7,50.16 IC40.12 | 77.47,50.16 101.28,50.16 | 131.13,50.16 v131.44,50.48 | 101.28,50.16 131.13,50.16 | v156.53,50.48 156.21,50.16 131.13,50.16 | RN4.8 161.61,102.55 163.51,102.55 163.51,98.11 162.88,97.47 159.07,97.47 IC38.14 155.89,97.47 149.54,97.47 148.27,98.74 148.27,100.33 147.96,100.33 147.64,100.65 138.43,100.65 137.48,99.69 v136.53,99.69 | IC3.10 77.79,100.65 79.06,100.65 79.38,100.33 80.64,100.33 81.28,100.97 99.06,100.97 v99.38,101.28 v132.08,101.28 | v77.47,50.48 77.47,50.16
ADATA15
  Top 0.127: RN4.9 IC38.12 | IC40.11 52.39,49.21 52.39,72.71 IC44.11 | IC3.9 77.79,98.11 77.79,76.52 79.69,74.61 79.69,49.21 IC13.9
  Bottom 0.127: IC3.9 79.69,100.01 85.41,100.01 86.04,100.65 105.09,100.65 | IC7.12 105.09,100.65 | 134.3,99.38 133.03,100.65 105.09,100.65 | IC38.12 160.34,101.28 136.21,101.28 134.3,99.38 | 134.3,99.38 IC34.9 | 77.15,49.85 IC13.9 | 77.15,49.85 54.93,49.85 IC40.11 | 105.09,49.85 IC17.12 | 77.15,49.85 105.09,49.85 | 133.03,49.85 IC24.9 | 105.09,49.85 133.03,49.85 | IC28.12 161.29,49.53 160.66,49.53 160.34,49.85 133.03,49.85
ADDR0  (via drill 0.25)
  Top 0.127: IC25.9 163.19,3.17 163.19,8.89 163.83,9.53 163.83,30.16 | 163.83,30.16 163.83,52.07 IC35.9 | IC20.9 106.68,8.26 105.41,9.53 105.41,20.32 | 105.41,29.53 105.41,49.53 106.68,50.8 IC10.9 | 105.41,29.53 105.41,20.32 | v80.96,18.1 82.23,19.37 v82.23,20.64 | 105.41,20.32 v103.82,20.32 | v163.51,30.16 163.83,30.16 | v141.6,30.16 140.02,31.75 138.43,31.75 v138.43,31.11 | 105.41,29.53 v107.31,29.53
  Bottom 0.127: X1.A3 6.35,21.59 16.51,21.59 17.78,20.32 35.24,20.32 36.51,21.59 38.1,21.59 40.32,19.37 57.78,19.37 58.1,19.05 60.96,19.05 61.91,18.1 v80.96,18.1 | v82.23,20.64 83.19,21.59 85.09,21.59 86.68,20 100.65,20 101.28,20.64 103.5,20.64 v103.82,20.32 | v141.6,30.16 v163.51,30.16 | v138.43,31.11 138.11,31.43 116.84,31.43 114.62,29.21 109.86,29.21 109.54,29.53 v107.31,29.53
ADDR1  (via drill 0.25)
  Top 0.127: IC25.7 158.75,3.81 158.75,52.07 IC35.7 | IC20.7 100.33,3.81 100.33,6.03 | 100.33,6.03 100.33,52.07 IC10.7 | 100.33,6.03 v106.05,6.03
  Route15 0.127: v63.82,12.38 82.23,12.38 90.49,4.13 100.01,4.13 IC20.7 | IC25.7 153.99,6.03 138.75,6.03 v138.43,5.71
  Bottom 0.127: X1.A4 3.81,24.13 3.81,15.88 15.24,15.88 17.46,13.65 62.55,13.65 v63.82,12.38 | v138.43,5.71 115.25,5.71 114.62,6.35 106.36,6.35 v106.05,6.03
ADDR2  (via drill 0.25)
  Top 0.127: IC25.5 151.13,3.81 151.13,8.26 | 151.13,8.26 151.13,52.07 IC35.5 | IC20.5 94.93,4.13 94.93,6.67 | 94.93,45.72 94.93,51.75 IC10.5 | 94.93,45.72 94.93,6.67 | X1.A5 6.03,28.89 v6.03,41.59 | v81.28,43.18 82.55,44.45 85.09,44.45 v85.09,45.09 | 94.93,45.72 v94.61,45.72 | v149.86,8.26 151.13,8.26 | 94.93,6.67 v97.16,6.67
  Bottom 0.127: v6.03,41.59 6.35,41.91 29.21,41.91 29.84,42.55 57.47,42.55 58.1,41.91 60.33,41.91 61.59,43.18 v81.28,43.18 | v85.09,45.09 85.72,45.72 v94.61,45.72 | v149.86,8.26 140.65,8.26 140.02,8.89 135.89,8.89 135.25,8.26 115.25,8.26 114.62,8.89 110.49,8.89 108.27,6.67 v97.16,6.67
ADDR3  (via drill 0.25)
  Top 0.127: IC25.3 v147.32,4.76 147.32,8.26 146.05,9.53 146.05,52.07 IC35.3 | IC20.3 90.17,3.81 90.17,4.76 | 90.17,6.99 90.17,51.12 91.44,52.39 IC10.3 | 90.17,6.99 90.17,4.76 | v78.11,30.48 79.69,28.89 79.69,21.91 78.11,20.32 81.92,16.51 85.72,16.51 86.04,16.83 87.63,16.83 87.63,9.53 90.17,6.99 | 90.17,4.76 v92.39,4.76
  Bottom 0.127: X1.A6 3.49,32.07 3.49,34.29 16.51,34.29 17.14,33.66 35.88,33.66 36.51,34.29 38.1,34.29 39.69,32.7 57.15,32.7 58.1,31.75 60.96,31.75 62.23,30.48 v78.11,30.48 | v147.32,4.76 147,4.45 140.65,4.45 140.02,3.81 139.38,3.81 138.75,4.45 115.25,4.45 114.3,3.49 110.17,3.49 108.9,4.76 v92.39,4.76
ADDR4  (via drill 0.25)
  Top 0.127: v164.47,17.14 164.15,17.46 164.15,63.82 162.56,65.41 IC36.9 | IC19.9 107.95,16.51 107.95,19.05 | 107.95,19.05 107.95,64.77 IC9.9 | v82.87,19.37 83.19,19.37 83.5,19.05 v85.09,19.05 | 107.95,19.05 v106.05,19.05
  Bottom 0.127: v164.47,17.14 IC26.9 160.66,17.14 140.65,17.14 140.02,16.51 139.38,16.51 137.16,18.73 114.94,18.73 114.62,19.05 v106.05,19.05 v85.09,19.05 | X1.A7 6.67,31.43 6.67,21.91 16.83,21.91 18.1,20.64 34.92,20.64 36.2,21.91 38.42,21.91 39.05,21.27 57.78,21.27 58.1,21.59 60.33,21.59 60.96,20.95 81.28,20.95 v82.87,19.37
ADDR5  (via drill 0.25)
  Top 0.127: IC26.7 158.43,16.19 158.43,50.48 156.53,52.39 156.53,65.09 IC36.7 | IC19.7 102.87,16.51 102.87,32.7 | 102.87,32.7 102.87,62.55 101.6,63.82 IC9.7 | 102.87,32.7 v102.23,32.7
  Route15 0.127: IC26.7 156.84,15.88 156.84,16.51 156.53,16.83 138.43,16.83 135.25,13.65 v120.02,13.65
  Bottom 0.127: X1.A8 6.03,34.61 16.83,34.61 17.46,33.97 35.56,33.97 36.2,34.61 38.42,34.61 39.69,33.34 57.15,33.34 58.1,34.29 59.05,34.29 61.59,31.75 88.58,31.75 89.53,32.7 v102.23,32.7 | v120.02,13.65 103.19,13.65 IC19.7
ADDR6  (via drill 0.25)
  Top 0.127: IC26.5 153.67,16.51 153.67,62.87 153.35,63.18 153.35,65.09 IC36.5 | IC19.5 97.79,16.51 97.79,64.77 IC9.5
  Route2 0.127: v103.82,56.83 100.01,60.64 100.01,62.55 IC9.5
  Route15 0.127: IC36.5 150.81,64.45 115.57,64.45 107.95,56.83 v103.82,56.83
  Bottom 0.127: X1.A9 4.76,38.42 4.13,38.42 3.49,39.05 3.49,52.07 29.84,52.07 30.16,51.75 74.61,51.75 74.93,51.44 104.14,51.44 105.09,52.39 105.09,56.83 v103.82,56.83
ADDR7  (via drill 0.25)
  Top 0.127: IC26.3 146.37,16.19 146.37,43.18 148.59,45.4 148.59,62.87 147.32,64.14 IC36.3 | IC19.3 92.71,16.51 92.71,33.66 | 92.71,57.47 92.71,63.18 91.44,64.45 IC9.3 | 92.71,57.47 92.71,33.66 | v56.83,39.05 59.05,36.83 v59.05,34.92 | 92.71,33.66 v90.81,33.66 | 92.71,57.47 v92.39,57.47
  Route2 0.127: IC36.3 143.83,62.55 140.65,62.55 v137.48,59.37
  Bottom 0.127: X1.A10 5.4,40.96 6.35,40.96 6.99,41.59 29.53,41.59 30.16,42.23 53.66,42.23 v56.83,39.05 | v59.05,34.92 61.28,32.7 81.92,32.7 83.5,34.29 85.09,34.29 85.72,33.66 v90.81,33.66 | v137.48,59.37 137.16,59.05 117.47,59.05 115.57,57.15 104.14,57.15 103.82,57.47 v92.39,57.47
ADDR8  (via drill 0.25)
  Top 0.127: IC27.9 162.88,28.26 162.88,33.97 163.51,34.61 163.51,50.48 161.61,52.39 v161.61,55.56 161.61,77.79 IC37.9 | v108.58,30.16 110.17,31.75 110.17,43.81 | 110.17,54.29 110.17,57.15 108.27,59.05 108.27,75.25 106.68,76.83 IC8.9 | 110.17,54.29 110.17,43.81 | 110.17,43.81 v108.58,43.81 | 110.17,54.29 v111.44,54.29
  Bottom 0.127: IC18.9 106.68,30.16 v108.58,30.16 | X1.A11 6.35,44.45 80.96,44.45 83.5,41.91 84.77,41.91 87,44.13 93.03,44.13 93.34,43.81 v108.58,43.81 | v161.61,55.56 140.97,55.56 140.02,54.61 139.38,54.61 138.75,55.24 115.89,55.24 114.94,54.29 v111.44,54.29
ADDR9  (via drill 0.25)
  Top 0.127: v102.23,31.11 102.23,28.57 IC18.7 101.6,32.7 102.55,33.66 102.55,45.4 v102.23,45.72 | IC27.7 157.48,31.11 v156.84,31.75 156.53,32.07 156.53,39.69 155.89,40.32 155.89,50.48 156.21,50.8 156.21,77.47 IC37.7 | IC8.7 102.87,77.47 102.87,70.8 | 102.87,70.8 102.87,63.18 103.19,62.87 103.19,46.35 v103.5,46.04 | X1.A12 6.67,47.31 v6.67,61.91 | 102.87,70.8 v101.6,70.8
  Bottom 0.127: v102.23,31.11 102.87,31.75 v156.84,31.75 | v103.5,46.04 103.19,45.72 v102.23,45.72 | v6.67,61.91 6.99,62.23 29.84,62.23 31.75,64.14 45.72,64.14 47.31,65.72 47.31,67.63 55.88,67.63 58.1,69.85 76.2,69.85 77.79,71.44 82.55,71.44 83.5,72.39 85.09,72.39 86.68,70.8 v101.6,70.8
ADDR10  (via drill 0.25)
  Top 0.127: IC27.5 151.45,26.99 151.45,20 | 151.45,20 151.45,14.29 152.08,13.65 153.99,13.65 153.99,63.18 153.67,63.5 153.67,70.48 151.45,72.71 151.45,77.79 IC37.5 | IC18.5 97.47,28.89 97.47,37.78 95.57,39.69 v95.57,45.72 | v98.42,46.04 98.11,46.35 98.11,75.88 96.52,77.47 IC8.5 | v151.76,20 151.45,20
  Route15 0.127: v54.93,45.09 55.56,45.09 60.33,49.85 82.87,49.85 86.36,46.35 94.93,46.35 v95.57,45.72 | v102.23,20 100.01,22.23 100.01,24.45 IC18.5
  Bottom 0.127: v95.57,45.72 95.89,46.04 v98.42,46.04 | X1.A13 6.35,46.99 29.84,46.99 31.75,45.09 v54.93,45.09 | v151.76,20 141.6,20 140.02,21.59 135.89,21.59 135.25,20.95 115.25,20.95 114.62,21.59 110.49,21.59 108.58,19.68 102.55,19.68 v102.23,20
ADDR11  (via drill 0.25)
  Top 0.127: IC27.3 148.27,26.99 148.27,1.59 147.64,0.95 143.51,0.95 v143.51,44.45 143.51,57.78 146.05,60.33 146.05,77.47 IC37.3 | IC18.3 90.49,26.99 90.49,14.29 91.12,13.65 93.03,13.65 93.03,44.45 | 93.03,44.45 93.03,63.5 92.39,64.14 92.39,76.2 91.44,77.15 IC8.3 | v56.83,51.12 59.69,48.26 v59.69,45.09 | 93.03,44.45 v93.34,44.45
  Bottom 0.127: X1.A14 6.03,51.75 29.53,51.75 30.16,51.12 v56.83,51.12 | v59.69,45.09 60.01,44.77 83.19,44.77 83.5,44.45 v93.34,44.45 114.62,44.45 114.94,44.13 116.84,44.13 117.16,44.45 v143.51,44.45
ADDR12  (via drill 0.25)
  Top 0.127: IC28.9 161.93,41.27 161.93,46.99 161.61,47.31 161.61,51.75 160.97,52.39 160.97,89.85 IC38.9 | IC17.9 107.63,41.59 107.63,63.18 105.73,65.09 105.73,88.9 | 105.73,88.9 106.68,89.85 IC7.9 | v81.6,55.24 87.31,49.53 v87.31,43.18 | 105.73,88.9 v109.54,88.9
  Route15 0.127: IC38.9 160.97,89.85 149.22,89.85 147.64,88.27 142.24,88.27 v141.6,88.9
  Bottom 0.127: X1.A15 6.35,54.61 29.84,54.61 30.16,54.93 56.52,54.93 56.83,54.61 60.33,54.61 60.96,55.24 v81.6,55.24 | v87.31,43.18 104.14,43.18 IC17.9 | v141.6,88.9 141.29,89.22 109.86,89.22 v109.54,88.9
ADDR13  (via drill 0.25)
  Top 0.127: IC7.7 100.33,90.17 100.33,60.33 102.55,58.1 102.55,47.31 101.6,46.35 IC17.7 100.65,39.69 100.65,20 v100.97,19.68 | IC38.7 157.16,91.12 v157.16,89.22 | v142.88,88.9 143.19,88.58 143.19,58.74 142.88,58.42 142.88,54.61 143.19,54.29 143.19,44.77 v140.65,42.23
  Route15 0.127: v140.65,42.23 137.16,38.73 132.08,38.73 v131.44,38.1
  Bottom 0.127: IC28.7 155.57,42.55 140.97,42.55 v140.65,42.23 | v131.44,38.1 131.13,37.78 104.46,37.78 IC17.7 | v157.16,89.22 156.53,88.58 143.19,88.58 v142.88,88.9 | X1.A16 1.91,52.7 1.91,26.35 5.71,26.35 6.03,26.04 6.03,23.81 4.45,23.81 4.13,23.5 4.13,19.05 55.56,19.05 58.1,16.51 60.33,16.51 61.28,17.46 81.92,17.46 83.5,19.05 84.45,19.05 85.09,19.68 v100.97,19.68
ADDR14  (via drill 0.25)
  Top 0.127: IC28.5 153.35,41.59 153.35,62.55 152.72,63.18 v152.72,63.5 | v154.31,63.5 155.89,65.09 v155.89,89.22 | v152.72,89.22 152.4,89.53 IC38.5 152.08,91.76 v152.08,95.89 | IC17.5 97.47,41.59 97.47,46.35 | 97.47,46.35 97.47,63.18 95.57,65.09 95.57,90.49 IC7.5 96.52,93.03 v98.42,94.93 | v56.83,55.24 60.01,52.07 60.01,46.67 v61.28,45.4 | 97.47,46.35 v95.57,46.35
  Bottom 0.127: v154.31,63.5 v152.72,63.5 | v152.72,89.22 v155.89,89.22 | X1.A17 6.35,57.15 31.75,57.15 33.66,55.24 v56.83,55.24 | v61.28,45.4 61.59,45.72 82.23,45.72 83.5,46.99 84.14,46.99 84.77,46.35 v95.57,46.35 | v152.08,95.89 150.81,97.16 140.65,97.16 140.02,97.79 139.38,97.79 137.16,95.57 114.94,95.57 114.62,95.25 113.67,95.25 113.35,94.93 v98.42,94.93
ADDR15  (via drill 0.25)
  Top 0.127: IC28.3 148.91,42.23 148.91,56.52 v149.22,56.83 | v147.96,57.78 146.37,59.37 146.37,75.88 148.27,77.79 148.27,89.53 147.32,90.49 IC38.3 | IC17.3 92.39,41.59 92.39,56.52 90.17,58.74 | 90.17,58.74 v90.17,81.6 90.17,90.17 IC7.3 | v81.6,57.47 82.55,56.52 82.55,55.24 86.04,51.75 90.17,51.75 90.17,58.74
  Route15 0.127: IC38.3 145.41,89.53 140.65,89.53 v132.72,81.6
  Bottom 0.127: v149.22,56.83 148.27,57.78 v147.96,57.78 | X1.A18 6.35,59.69 29.84,59.69 32.38,57.15 81.28,57.15 v81.6,57.47 | v132.72,81.6 132.08,80.96 115.57,80.96 114.62,80.01 113.67,80.01 112.08,81.6 v90.17,81.6
ADDR-ID0  (via drill 0.25)
  Top 0.127: IC41.2 40.64,93.98 IC41.14 | X1.B9 8.89,39.37 v8.89,88.58
  Bottom 0.127: v8.89,88.58 8.89,92.39 23.18,92.39 25.72,89.85 36.51,89.85 IC41.2
ADDR-ID1
  Top 0.127: IC41.3 40.96,91.76 40.96,96.84 41.91,97.79 | IC41.13 41.91,97.79 | X1.B10 8.26,41.27 8.26,42.23 8.57,42.55 8.57,87 7.62,87.95 6.67,87.95 6.67,99.38 19.37,112.08 41.91,112.08 41.91,97.79
ADDR-ID2-SEL
  Top 0.127: IC11.2 IC11.1 5.08,2.54 BUS.2 0.1
ADDR-REG-ADDR-RD  (via drill 0.25)
  Top 0.127: v25.72,76.83 24.45,75.56 24.45,40.01 | 24.45,40.01 24.45,28.89 IC2.4 | 24.45,40.01 v24.77,40.01
  Bottom 0.127: IC2.5 IC2.4 | IC48.11 47.94,80.96 29.84,80.96 v25.72,76.83 | X1.C10 10.79,40.01 v24.77,40.01
ADDR-REG-DATA-RD-HI  (via drill 0.25)
  Top 0.127: IC1.10 79.38,111.12 79.38,110.17 | v79.38,108.27 79.38,110.17 | v121.6,108.27 124.46,111.12 IC39.10 | IC12.10 48.26,32.07 49.53,33.34 IC29.10 | 79.38,110.17 74.61,110.17 74.61,112.71 73.98,113.35 72.07,113.35 72.07,109.54 67.31,104.78 v67.31,36.83
  Bottom 0.127: v79.38,108.27 79.69,107.95 118.11,107.95 118.43,108.27 v121.6,108.27 | X1.C9 10.79,37.47 41.91,37.47 43.5,35.88 43.5,33.97 47.94,33.97 | IC29.10 47.94,33.97 | v67.31,36.83 66.99,37.15 54.29,37.15 53.02,35.88 53.02,33.97 47.94,33.97
ADDR-REG-DATA-RD-LO  (via drill 0.25)
  Top 0.127: IC12.13 40.64,34.29 IC29.13 | IC1.13 67.31,107.95 67.31,105.41 61.91,100.01 61.91,68.9 56.2,63.18 v56.2,34.92
  Bottom 0.127: IC1.13 72.71,113.35 115.25,113.35 IC39.13 | X1.C8 11.75,37.15 39.69,37.15 | 39.69,37.15 40.32,37.15 IC29.13 | v56.2,34.92 54.93,33.66 43.18,33.66 39.69,37.15
ADDR-REG-DN  (via drill 0.25)
  Top 0.127: IC30.5 v96.2,109.54 | IC43.13 42.86,21.91 v42.86,17.78 | v13.02,25.4 13.02,45.4 X1.C13 9.21,49.21 9.21,51.75 10.16,51.75 11.11,52.7 11.11,94.61 v24.45,107.95
  Bottom 0.127: v96.2,109.54 IC30.13 92.39,110.17 89.53,110.17 89.22,110.49 85.09,110.49 83.5,108.9 67.31,108.9 66.36,107.95 v24.45,107.95 | v42.86,17.78 43.5,17.14 47.62,17.14 IC43.5 | v13.02,25.4 13.65,24.77 33.34,24.77 33.97,25.4 39.37,25.4 IC43.13
ADDR-REG-FUNC
  Top 0.127: IC11.9 IC11.6
  Bottom 0.127: IC11.13 20.64,11.75 27.62,11.75 IC11.9
ADDR-REG-FUNC-LD  (via drill 0.25)
  Top 0.127: IC40.1 29.53,41.59 29.53,52.39 | IC45.1 29.53,52.39 | IC44.1 29.53,65.09 29.53,52.39 | IC49.2 16.51,19.05 16.51,21.27 14.29,23.5 | 14.29,23.5 11.11,26.67 11.11,29.53 X1.C6 | v21.27,40.64 18.73,38.1 18.73,30.8 14.29,26.35 14.29,23.5
  Bottom 0.127: v21.27,40.64 IC40.1
ADDR-REG-FUNC-RD
  Top 0.127: IC49.1 9.21,15.24 9.21,32.07 X1.C7
ADDR-REG-LD-HI  (via drill 0.25)
  Top 0.127: IC12.5 49.85,4.13 49.85,13.65 50.48,14.29 50.48,26.99 IC29.5 53.02,31.43 53.02,35.88 54.29,37.15 54.29,58.74 54.93,59.37 54.93,68.58 54.61,68.9 54.61,105.73 v54.29,106.05 | X1.C12 12.38,43.5 v12.38,28.26
  Bottom 0.127: IC39.5 122.87,105.73 113.98,105.73 113.67,105.41 111.44,105.41 111.12,105.73 91.12,105.73 90.81,105.41 88.58,105.41 88.27,105.73 80.33,105.73 IC1.5 77.15,105.73 66.67,105.73 66.36,105.41 65.09,105.41 64.45,106.05 v54.29,106.05 | v12.38,28.26 14.29,26.35 45.4,26.35 45.72,26.67 46.35,26.67 46.67,26.35 47.94,26.35 IC29.5
ADDR-REG-LD-LO
  Top 0.127: IC29.2 40.96,26.99 40.96,14.29 41.59,13.65 41.59,3.49 IC12.2 40.64,0.95 | X1.C11 9.21,42.23 9.21,32.7 8.89,32.38 8.89,14.92 19.68,4.13 22.86,4.13 22.86,1.91 24.13,0.64 40.64,0.64 40.64,0.95 | IC1.2 69.85,102.87 69.85,12.38 69.22,11.75 69.22,11.43 69.53,11.11 69.53,1.59 68.9,0.95 40.64,0.95
  Bottom 0.127: IC1.2 72.71,102.55 115.25,102.55 IC39.2
ADDR-REG-UP  (via drill 0.25)
  Top 0.127: IC30.2 95.25,105.41 95.25,110.17 | 95.25,110.17 95.25,112.39 96.2,113.35 101.6,113.35 IC30.10 | IC43.2 45.4,11.75 47.31,11.75 47.31,9.21 47.94,8.57 49.21,8.57 49.21,13.65 48.58,14.29 48.58,21.91 IC43.10 | v13.65,25.4 13.65,47.31 X1.C14 13.97,54.61 13.97,96.84 v25.72,108.58 | 95.25,110.17 90.17,110.17 v90.17,110.81
  Bottom 0.127: v13.65,25.4 13.97,25.72 45.4,25.72 46.67,24.45 47.94,24.45 IC43.10 | v90.17,110.81 84.77,110.81 83.82,109.86 66.99,109.86 66.36,110.49 61.59,110.49 60.96,109.86 44.13,109.86 43.5,110.49 27.62,110.49 v25.72,108.58
DATA0  (via drill 0.25)
  Top 0.127: IC45.2 32.07,54.29 32.07,63.18 | 32.07,63.18 32.07,65.09 IC44.2 | 32.07,63.18 v30.16,63.18
  Bottom 0.127: X1.A19 6.03,62.55 29.53,62.55 v30.16,63.18
DATA1
  Top 0.127: IC45.3 34.61,54.29 34.61,65.09 IC44.3
  Bottom 0.127: X1.A20 6.67,64.45 33.97,64.45 IC44.3
DATA2
  Top 0.127: IC45.4 37.15,54.29 37.15,65.09 IC44.4
  Bottom 0.127: X1.A21 6.67,66.99 29.53,66.99 30.16,67.63 36.51,67.63 IC44.4
DATA3  (via drill 0.25)
  Top 0.127: IC45.5 39.69,54.29 39.69,65.09 IC44.5 | X1.A22 6.03,70.17 v6.03,66.99
  Bottom 0.127: v6.03,66.99 5.4,67.63 4.45,67.63 4.13,67.94 4.13,69.53 25.4,69.53 27.62,67.31 29.21,67.31 29.84,67.94 38.73,67.94 IC44.5
DATA4  (via drill 0.25)
  Top 0.127: IC45.6 42.23,54.29 42.23,65.09 IC44.6 43.18,68.58 v41.27,70.48
  Bottom 0.127: X1.A23 6.03,72.71 29.53,72.71 31.75,70.48 v41.27,70.48
DATA5  (via drill 0.25)
  Top 0.127: IC45.7 44.77,54.29 44.77,65.09 IC44.7 45.72,68.26 v45.09,68.9
  Bottom 0.127: X1.A24 5.08,74.61 4.45,74.61 4.13,74.3 4.13,72.39 29.21,72.39 32.7,68.9 v45.09,68.9
DATA6  (via drill 0.25)
  Top 0.127: IC45.8 47.31,54.29 47.31,65.09 IC44.8 48.26,67.31 v47.31,68.26
  Bottom 0.127: X1.A25 3.49,77.15 3.49,69.85 30.8,69.85 32.38,68.26 v47.31,68.26
DATA7  (via drill 0.25)
  Top 0.127: IC45.9 49.85,54.29 49.85,65.09 IC44.9 50.8,71.44 v50.16,72.07
  Bottom 0.127: X1.A26 6.67,79.69 6.67,75.25 35.88,75.25 37.15,73.98 37.15,72.07 v50.16,72.07
DATA8  (via drill 0.25)
  Top 0.127: v33.02,45.72 IC40.2 | v4.13,49.85 4.13,82.87 X1.A27
  Bottom 0.127: v33.02,45.72 31.43,47.31 31.43,49.85 v4.13,49.85
DATA9  (via drill 0.25)
  Top 0.127: v4.13,39.05 2.22,40.96 2.22,83.5 X1.A28
  Bottom 0.127: IC40.3 33.97,39.05 v4.13,39.05
DATA10  (via drill 0.25)
  Top 0.127: IC40.4 36.83,41.91 v36.83,81.6
  Bottom 0.127: v36.83,81.6 35.88,82.55 15.56,82.55 10.48,87.63 6.35,87.63 X1.A29
DATA11  (via drill 0.25)
  Top 0.127: IC40.5 39.37,41.91 v39.37,81.6
  Bottom 0.127: v39.37,81.6 36.2,84.77 28.57,84.77 25.4,87.95 6.99,87.95 6.03,88.9 6.03,91.44 X1.A30
DATA12  (via drill 0.25)
  Top 0.127: IC40.6 40.32,37.78 40.32,31.11 v33.97,24.77
  Bottom 0.127: v33.97,24.77 33.66,24.45 9.21,24.45 X1.B3
DATA13  (via drill 0.25)
  Top 0.127: v45.72,26.04 IC40.7
  Bottom 0.127: v45.72,26.04 11.11,26.04 10.79,26.35 8.57,26.35 X1.B4
DATA14  (via drill 0.25)
  Top 0.127: IC40.8 47.94,40.32 47.94,33.02 v46.35,31.43
  Bottom 0.127: v46.35,31.43 44.77,29.84 37.78,29.84 37.15,29.21 33.66,29.21 33.34,29.53 15.88,29.53 15.24,28.89 8.57,28.89 X1.B5
DATA15  (via drill 0.25)
  Top 0.127: IC40.9 50.48,40.32 v50.48,32.07
  Bottom 0.127: v50.48,32.07 37.47,32.07 37.15,31.75 8.89,31.75 X1.B6
GND
  pour Route15: 1.27,113.03 176.53,113.03 176.53,0 0,0 0,113.03
H/L-SWAP  (via drill 0.25)
  Top 0.127: IC11.10 26.67,19.68 24.13,22.23 v24.13,75.88
  Bottom 0.127: v24.13,75.88 21.27,78.74 14.29,78.74 | X1.C25 14.29,78.74 | IC42.11 51.75,113.35 29.21,113.35 11.11,95.25 11.11,92.71 4.76,92.71 4.13,92.08 4.13,82.23 10.79,82.23 14.29,78.74
IA-0
  Bottom 0.127: IC35.11 166.69,59.37 168.91,59.37 170.5,57.78 170.5,54.93 171.45,53.98 JP2.5 169.86,51.75 143.19,51.75 | IC31.3 123.51,51.75 143.19,51.75 | IC35.2 143.19,51.75
IA-1  (via drill 0.25)
  Top 0.127: IC35.13 159.38,60.33 v159.38,54.93 | JP2.7 170.5,51.75 v170.5,54.29
  Bottom 0.127: IC31.2 120.97,54.93 138.43,54.93 139.06,54.29 141.29,54.29 141.92,54.93 148.27,54.93 | IC35.4 148.27,54.93 | 148.27,54.93 v159.38,54.93 169.86,54.93 v170.5,54.29
IA-2  (via drill 0.25)
  Top 0.127: v129.54,51.12 IC31.6 | v154.62,51.12 154.94,51.44 IC35.6 IC35.15
  Bottom 0.127: v129.54,51.12 129.86,51.44 154.31,51.44 v154.62,51.12 169.86,51.12 170.5,51.75 174.94,51.75 174.94,50.16 174.31,49.53 172.72,49.53 JP2.9
IA-3  (via drill 0.25)
  Top 0.127: IC35.8 160.66,52.7 160.66,50.48 161.29,49.85 v161.29,45.72 | IC31.7 133.35,54.61 v133.35,63.5 | v149.54,63.82 149.86,63.5 IC35.17 149.86,60.01 150.81,59.05 150.81,46.04 v150.5,45.72
  Bottom 0.127: JP2.11 v161.29,45.72 v150.5,45.72 | v133.35,63.5 133.67,63.82 v149.54,63.82
IA-4  (via drill 0.25)
  Top 0.127: v145.41,71.75 144.78,71.12 IC36.2 | v167.64,43.5 167.64,71.12 IC36.11
  Bottom 0.127: IC32.3 123.51,64.45 143.19,64.45 IC36.2 | IC36.11 163.19,71.75 v145.41,71.75 | JP2.13 171.13,43.5 v167.64,43.5
IA-5  (via drill 0.25)
  Top 0.127: v150.5,75.88 150.81,75.56 150.81,66.99 150.18,66.36 | JP2.15 170.18,41.91 170.18,53.98 169.23,54.93 v169.23,56.83 | v152.72,57.78 150.81,59.69 150.81,61.91 150.18,62.55 150.18,66.36 | 150.18,66.36 IC36.4
  Bottom 0.127: IC32.2 121.28,64.14 147.96,64.14 IC36.4 | IC36.13 161.61,72.07 162.88,72.07 163.51,72.71 163.51,75.88 v150.5,75.88 | v169.23,56.83 168.28,57.78 v152.72,57.78
IA-6  (via drill 0.25)
  Top 0.127: IC36.6 IC36.15 | v166.69,38.42 166.37,38.73 v166.37,64.14
  Bottom 0.127: IC32.6 131.13,67.63 138.43,67.63 139.06,66.99 141.29,66.99 141.92,67.63 153.35,67.63 | IC36.6 153.35,67.63 | JP2.17 171.13,38.42 v166.69,38.42 | v166.37,64.14 166.37,67.63 153.35,67.63
IA-7  (via drill 0.25)
  Top 0.127: v132.08,63.18 IC32.7 | IC36.17 148.91,72.71 v148.91,63.18 | v167.96,36.2 167.96,42.55 167,43.5 v167,62.87
  Bottom 0.127: v132.08,63.18 132.4,62.87 148.91,62.87 | 148.91,62.87 156.84,62.87 158.43,64.45 | IC36.8 158.43,64.45 | 148.91,62.87 v148.91,63.18 | JP2.19 170.81,36.2 v167.96,36.2 | v167,62.87 165.42,64.45 158.43,64.45
IA-8  (via drill 0.25)
  Top 0.127: v147.64,83.19 144.78,80.33 IC37.2 | JP2.21 173.04,34.61 173.04,48.9 173.67,49.53 176.85,49.53 176.85,82.55 v176.53,82.87
  Bottom 0.127: IC33.3 123.51,80.33 137.79,80.33 138.43,79.69 141.29,79.69 141.92,80.33 143.19,80.33 IC37.2 | 163.83,85.09 161.93,83.19 v147.64,83.19 | 163.83,85.09 IC37.11 | v176.53,82.87 174.31,85.09 163.83,85.09
IA-9  (via drill 0.25)
  Top 0.127: IC33.2 119.7,78.42 v119.7,76.2 | v149.22,76.2 149.86,76.83 IC37.4 149.86,80.96 v152.72,83.82
  Route15 0.127: JP2.23 172.72,31.75 173.04,31.75 173.35,32.07 174.62,32.07 177.16,34.61 177.16,83.5 v176.53,84.14
  Bottom 0.127: v119.7,76.2 120.33,75.56 148.59,75.56 v149.22,76.2 | 158.43,84.77 157.48,83.82 v152.72,83.82 | 158.43,84.77 IC37.13 | v176.53,84.14 176.53,87.95 164.78,87.95 163.51,86.68 163.51,85.41 162.88,84.77 158.43,84.77
IA-10  (via drill 0.25)
  Top 0.127: IC33.6 130.18,78.11 v130.18,76.52 | v154.31,76.52 154.94,77.15 IC37.6 IC37.15 | v168.28,28.89 168.59,29.21 168.59,37.15 168.28,37.47 168.28,58.1 167.96,58.42 167.96,72.71 v166.37,74.3
  Bottom 0.127: v130.18,76.52 130.49,76.83 153.99,76.83 v154.31,76.52 164.15,76.52 v166.37,74.3 | JP2.25 170.5,28.89 v168.28,28.89
IA-11  (via drill 0.25)
  Top 0.127: IC33.7 132.72,78.11 v132.72,76.2 | v147.32,76.2 148.91,77.79 148.91,80.33 | 148.91,80.33 148.91,85.41 IC37.17 | 148.91,80.33 v149.22,80.33 | v167,25.72 167,37.47 166.05,38.42 166.05,62.55 163.51,65.09 163.51,73.98 166.05,76.52 v166.05,80.01
  Bottom 0.127: v147.32,76.2 v132.72,76.2 | 158.43,80.33 IC37.8 | v149.22,80.33 158.43,80.33 | JP2.27 171.13,25.72 v167,25.72 | v166.05,80.01 165.74,80.33 158.43,80.33
IA-12  (via drill 0.25)
  Top 0.127: v145.41,95.25 144.78,94.61 IC38.2 | v176.53,24.13 177.16,24.77 177.16,94.93 v174.31,97.79
  Bottom 0.127: IC34.3 123.51,89.85 143.19,89.85 IC38.2 | 164.15,98.11 161.29,95.25 v145.41,95.25 | 164.15,98.11 IC38.11 | JP2.29 172.72,24.13 v176.53,24.13 | v174.31,97.79 173.99,98.11 164.15,98.11
IA-13  (via drill 0.25)
  Top 0.127: v160.66,20 159.07,21.59 159.07,54.61 158.75,54.93 158.75,63.82 159.07,64.14 159.07,88.58 160.97,90.49 160.97,98.11 IC38.13
  Route15 0.127: IC38.13 153.99,93.03 151.45,93.03 IC38.4
  Bottom 0.127: IC34.2 121.28,89.53 147.64,89.53 149.54,91.44 IC38.4 | JP2.31 171.13,20 v160.66,20
IA-14  (via drill 0.25)
  Top 0.127: IC38.6 IC38.15 | v142.88,18.1 140.97,20 140.97,25.08 135.89,30.16 135.89,56.52 136.53,57.15 v136.53,90.49
  Bottom 0.127: IC34.6 130.18,92.08 130.81,92.08 131.76,93.03 136.53,93.03 | 136.53,93.03 138.43,93.03 139.06,92.39 141.29,92.39 141.92,93.03 153.35,93.03 IC38.6 | JP2.33 171.13,18.1 v142.88,18.1 | 136.53,93.03 v136.53,90.49
IA-15  (via drill 0.25)
  Top 0.127: IC34.7 135.89,95.25 v135.89,98.11 | IC38.8 159.07,92.39 159.07,100.33 v159.38,100.65 160.97,102.23 160.97,109.54 162.88,109.54 168.28,104.14 168.28,58.74 168.59,58.42 168.59,41.59 v168.91,41.27 | JP2.35 167.64,15.24 167.64,35.88 167.32,36.2 v167.32,39.69
  Bottom 0.127: v135.89,98.11 135.89,100.33 137.48,100.33 138.11,100.97 148.27,100.97 149.86,99.38 | v159.38,100.65 151.13,100.65 149.86,99.38 | 149.86,99.38 IC38.17 | v168.91,41.27 v167.32,39.69
IB-0  (via drill 0.25)
  Top 0.127: v146.69,5.4 144.78,3.49 IC25.2 | v166.37,35.56 166.05,35.24 166.05,11.11 IC25.11
  Bottom 0.127: IC21.3 123.51,0.95 143.19,0.95 IC25.2 | IC25.11 160.34,5.4 v146.69,5.4 | JP2.6 176.85,50.48 176.85,36.51 168.28,36.51 167.96,36.83 167.64,36.83 v166.37,35.56
IB-1  (via drill 0.25)
  Top 0.127: IC25.4 149.86,0.95 157.8,0.95 159.07,2.22 159.07,9.21 IC25.13 161.29,11.43 161.29,36.2 161.93,36.83 161.93,39.05 161.61,39.37 161.61,40.96 160.66,41.91 160.66,45.72 160.97,46.04 160.97,49.53 v160.02,50.48
  Bottom 0.127: IC21.2 121.28,0.64 147.96,0.64 IC25.4 | JP2.8 173.04,49.85 160.97,49.85 160.34,50.48 v160.02,50.48
IB-2  (via drill 0.25)
  Top 0.127: IC25.6 IC25.15 | JP2.10 174.94,47.31 174.94,42.86 175.9,41.91 175.9,26.67 175.58,26.35 175.58,9.53 v175.26,9.21
  Bottom 0.127: IC21.6 131.13,4.13 138.43,4.13 139.06,3.49 141.29,3.49 141.92,4.13 153.35,4.13 | IC25.6 153.35,4.13 | v175.26,9.21 170.18,4.13 153.35,4.13
IB-3  (via drill 0.25)
  Top 0.127: IC21.7 133.99,0.64 148.91,0.64 | 148.91,0.64 160.02,0.64 160.02,0.95 | IC25.8 160.02,0.95 | IC25.17 148.91,9.21 148.91,0.64 | v175.58,44.77 176.21,44.13 176.21,24.45 175.9,24.13 175.9,9.21 170.81,4.13 163.51,4.13 163.51,1.59 162.88,0.95 160.02,0.95
  Bottom 0.127: JP2.12 174.94,44.77 v175.58,44.77
IB-4  (via drill 0.25)
  Top 0.127: v145.41,20.64 144.78,20 IC26.2 | JP2.14 175.58,41.59 175.58,26.99 175.26,26.67 175.26,9.84 173.99,8.57 164.15,8.57 164.15,16.19 165.1,17.14 IC26.11
  Bottom 0.127: IC22.3 123.51,13.65 143.19,13.65 IC26.2 | IC26.11 162.88,20.64 v145.41,20.64
IB-5  (via drill 0.25)
  Top 0.127: v149.22,21.27 149.86,20.64 IC26.4 | v161.29,39.05 160.97,38.73 160.97,23.81 IC26.13
  Bottom 0.127: IC22.2 121.28,13.34 147.64,13.34 149.54,15.24 IC26.4 | IC26.13 158.43,21.27 v149.22,21.27 | JP2.16 172.4,39.05 v161.29,39.05
IB-6  (via drill 0.25)
  Top 0.127: IC26.6 IC26.15 155.89,23.81 155.89,33.66 v155.57,33.97
  Bottom 0.127: IC22.6 131.13,16.83 138.43,16.83 139.06,16.19 141.29,16.19 141.92,16.83 153.35,16.83 IC26.6 | JP2.18 172.72,36.83 168.59,36.83 168.28,37.15 164.78,37.15 163.51,35.88 163.51,33.97 v155.57,33.97
IB-7  (via drill 0.25)